# EAGLE schematic EK-TM4C129EXL REV A (EAGLE 6.5.0)

## Sheet 1 of 6: TM4C129ENCPDT GPIO
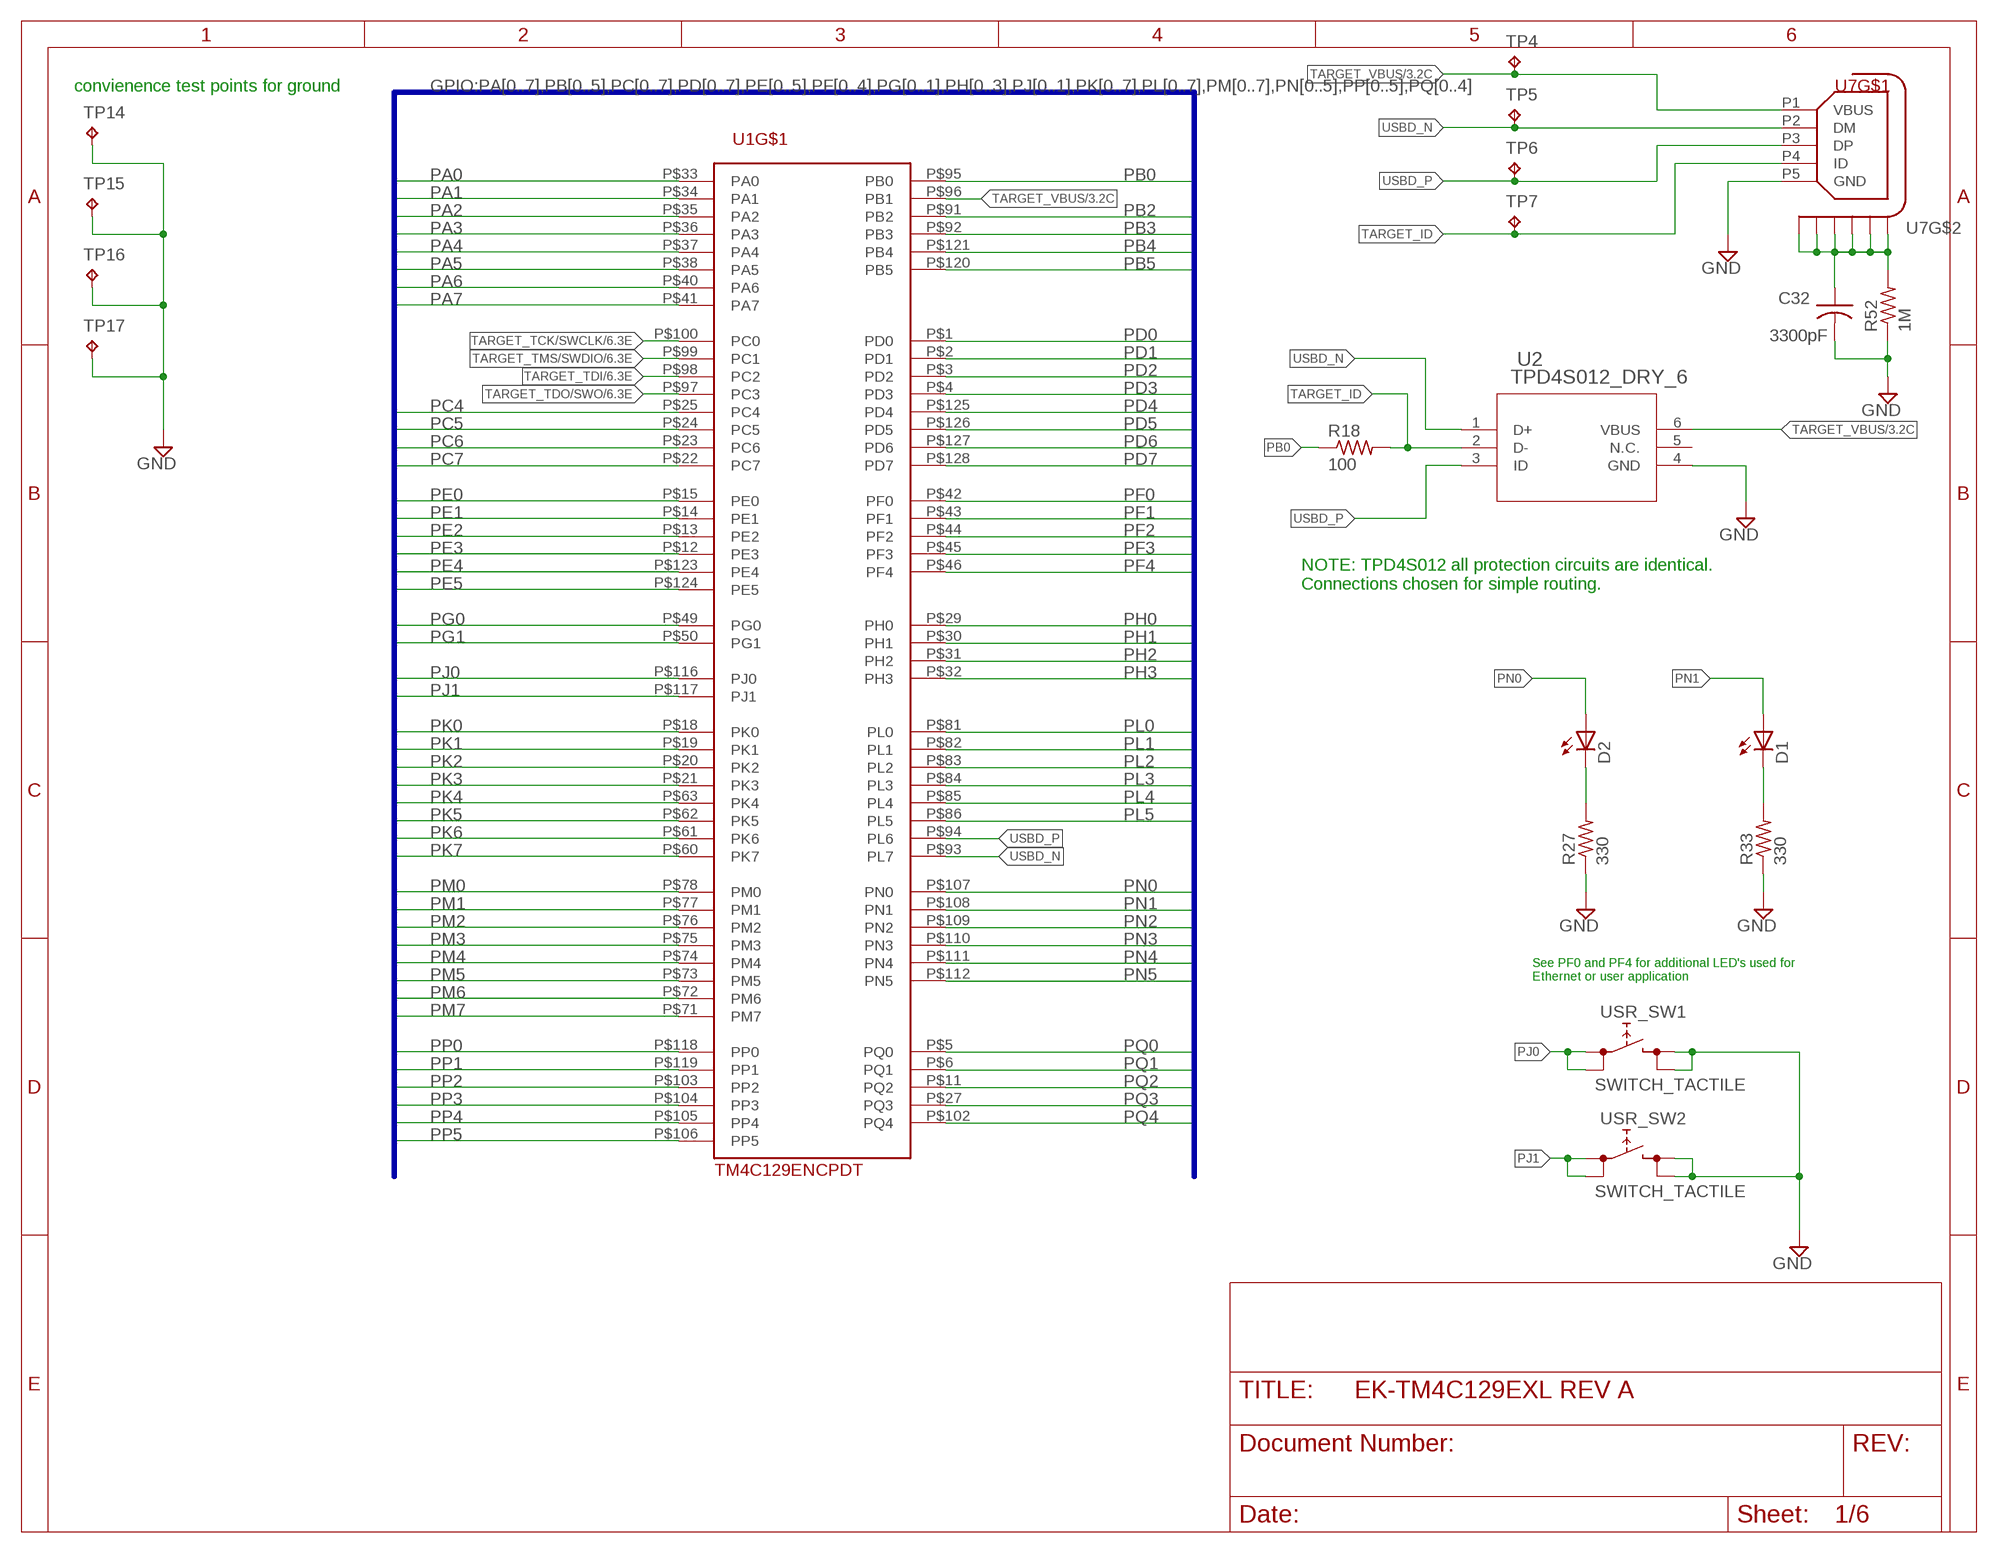
[diagram p0: schematic, sheet 1]

### Parts
C32  3300pF  C-USC0603  [C0603]
D1  LEDCHIPLED_0603  [CHIPLED_0603]
D2  LEDCHIPLED_0603  [CHIPLED_0603]
R18  100  R-US_R0402  [R0402]
R27  330  R-US_R0402  [R0402]
R33  330  R-US_R0402  [R0402]
R52  1M  R-US_R0603  [R0603]
TP4  TPPAD1-13  [P1-13]
TP5  TPPAD1-13  [P1-13]
TP6  TPPAD1-13  [P1-13]
TP7  TPPAD1-13  [P1-13]
TP14  TPPAD1-13  [P1-13]
TP15  TPPAD1-13  [P1-13]
TP16  TPPAD1-13  [P1-13]
TP17  TPPAD1-13  [P1-13]
U1  TM4C129ENCPDT  [TQFP-128]
U2  TPD4S012_DRY_6  [DRY6]
U7  CON_USB_HIROSE_MICRO_AB_ZX62D_AB_5P8  [CON_USB_MICRO_AB_HIROSE_ZX62D-AB-5P8]
USR_SW1  SWITCH_TACTILE  [SWITCH_6MM_6MM_TE_CON_SMD]
USR_SW2  SWITCH_TACTILE  [SWITCH_6MM_6MM_TE_CON_SMD]

### Nets
GND: C32.2 R27.1 R33.1 R52.1 TP14.TP TP15.TP TP16.TP TP17.TP U2.4(GND) U7.P5(GND) USR_SW1.P$3 USR_SW1.P$4 USR_SW2.P$3 USR_SW2.P$4 ; also sheet 2,3,4,5,6
N$6: D1.C R33.2
N$8: C32.1 R52.2 U7.P$1(S1) U7.P$2(S2) U7.P$3(S3) U7.P$4(S4) U7.P$5(S5) U7.P$6(S6)
N$14: D2.C R27.2
PA0: U1.P$33(PA0) ; also sheet 2,3
PA1: U1.P$34(PA1) ; also sheet 2,3
PA2: U1.P$35(PA2) ; also sheet 2,3
PA3: U1.P$36(PA3) ; also sheet 2,3
PA4: U1.P$37(PA4) ; also sheet 2,3
PA5: U1.P$38(PA5) ; also sheet 2,3
PA6: U1.P$40(PA6) ; also sheet 2,3
PA7: U1.P$41(PA7) ; also sheet 2,3
PB0: R18.1 U1.P$95(PB0) ; also sheet 3
PB2: U1.P$91(PB2) ; also sheet 2,3
PB3: U1.P$92(PB3) ; also sheet 2,3
PB4: U1.P$121(PB4) ; also sheet 2,3
PB5: U1.P$120(PB5) ; also sheet 2,3
PC4: U1.P$25(PC4) ; also sheet 2,3
PC5: U1.P$24(PC5) ; also sheet 2,3
PC6: U1.P$23(PC6) ; also sheet 2,3
PC7: U1.P$22(PC7) ; also sheet 2,3
PD0: U1.P$1(PD0) ; also sheet 2,3
PD1: U1.P$2(PD1) ; also sheet 2,3
PD2: U1.P$3(PD2) ; also sheet 2,3
PD3: U1.P$4(PD3) ; also sheet 2,3
PD4: U1.P$125(PD4) ; also sheet 2,3
PD5: U1.P$126(PD5) ; also sheet 2,3
PD6: U1.P$127(PD6) ; also sheet 3,5
PD7: U1.P$128(PD7) ; also sheet 2,3
PE0: U1.P$15(PE0) ; also sheet 2,3
PE1: U1.P$14(PE1) ; also sheet 2,3
PE2: U1.P$13(PE2) ; also sheet 2,3
PE3: U1.P$12(PE3) ; also sheet 2,3
PE4: U1.P$123(PE4) ; also sheet 2,3
PE5: U1.P$124(PE5) ; also sheet 2,3
PF0: U1.P$42(PF0) ; also sheet 3,4
PF1: U1.P$43(PF1) ; also sheet 2,3
PF2: U1.P$44(PF2) ; also sheet 2,3
PF3: U1.P$45(PF3) ; also sheet 2,3
PF4: U1.P$46(PF4) ; also sheet 3,4
PG0: U1.P$49(PG0) ; also sheet 2,3
PG1: U1.P$50(PG1) ; also sheet 2,3
PH0: U1.P$29(PH0) ; also sheet 2,3
PH1: U1.P$30(PH1) ; also sheet 2,3
PH2: U1.P$31(PH2) ; also sheet 2,3
PH3: U1.P$32(PH3) ; also sheet 2,3
PJ0: U1.P$116(PJ0) USR_SW1.P$1 USR_SW1.P$2 ; also sheet 3
PJ1: U1.P$117(PJ1) USR_SW2.P$1 USR_SW2.P$2 ; also sheet 3
PK0: U1.P$18(PK0) ; also sheet 2,3
PK1: U1.P$19(PK1) ; also sheet 2,3
PK2: U1.P$20(PK2) ; also sheet 2,3
PK3: U1.P$21(PK3) ; also sheet 2,3
PK4: U1.P$63(PK4) ; also sheet 2,3
PK5: U1.P$62(PK5) ; also sheet 2,3
PK6: U1.P$61(PK6) ; also sheet 2,3
PK7: U1.P$60(PK7) ; also sheet 2,3
PL0: U1.P$81(PL0) ; also sheet 2,3
PL1: U1.P$82(PL1) ; also sheet 2,3
PL2: U1.P$83(PL2) ; also sheet 2,3
PL3: U1.P$84(PL3) ; also sheet 2,3
PL4: U1.P$85(PL4) ; also sheet 2,3
PL5: U1.P$86(PL5) ; also sheet 2,3
PM0: U1.P$78(PM0) ; also sheet 2,3
PM1: U1.P$77(PM1) ; also sheet 2,3
PM2: U1.P$76(PM2) ; also sheet 2,3
PM3: U1.P$75(PM3) ; also sheet 2,3
PM4: U1.P$74(PM4) ; also sheet 2,3
PM5: U1.P$73(PM5) ; also sheet 2,3
PM6: U1.P$72(PM6) ; also sheet 2,3
PM7: U1.P$71(PM7) ; also sheet 2,3
PN0: D2.A U1.P$107(PN0) ; also sheet 3
PN1: D1.A U1.P$108(PN1) ; also sheet 3
PN2: U1.P$109(PN2) ; also sheet 2,3
PN3: U1.P$110(PN3) ; also sheet 2,3
PN4: U1.P$111(PN4) ; also sheet 2,3
PN5: U1.P$112(PN5) ; also sheet 2,3
PP0: U1.P$118(PP0) ; also sheet 2,3
PP1: U1.P$119(PP1) ; also sheet 2,3
PP2: U1.P$103(PP2) ; also sheet 2,3
PP3: U1.P$104(PP3) ; also sheet 2,3
PP4: U1.P$105(PP4) ; also sheet 2,3
PP5: U1.P$106(PP5) ; also sheet 2,3
PQ0: U1.P$5(PQ0) ; also sheet 2,3
PQ1: U1.P$6(PQ1) ; also sheet 2,3
PQ2: U1.P$11(PQ2) ; also sheet 2,3
PQ3: U1.P$27(PQ3) ; also sheet 2,3
PQ4: U1.P$102(PQ4) ; also sheet 3,5
TARGET_ID: R18.2 TP7.TP U2.2(D-) U7.P4(ID)
TARGET_TCK/SWCLK: U1.P$100(PC0) ; also sheet 6
TARGET_TDI: U1.P$98(PC2) ; also sheet 6
TARGET_TDO/SWO: U1.P$97(PC3) ; also sheet 6
TARGET_TMS/SWDIO: U1.P$99(PC1) ; also sheet 6
TARGET_VBUS: TP4.TP U1.P$96(PB1) U2.6(VBUS) U7.P1(VBUS) ; also sheet 3,5
USBD_N [USB]: TP5.TP U1.P$93(PL7) U2.1(D+) U7.P2(DM)
USBD_P [USB]: TP6.TP U1.P$94(PL6) U2.3(ID) U7.P3(DP)
Unconnected: U2.5(N.C.)

### Buses
GPIO:PA[0..7],PB[0..5],PC[0..7],PD[0..7],PE[0..5],PF[0..4],PG[0..1],PH[0..3],PJ[0..1],PK[0..7],PL[0..7],PM[0..7],PN[0..5],PP[0..5],PQ[0..4]

### Notes on the sheet
- convienence test points for ground
- NOTE: TPD4S012 all protection circuits are identical.  
  Connections chosen for simple routing.
- See PF0 and PF4 for additional LED's used for
  Ethernet or user application

## Sheet 2 of 6: BoosterPack Interface
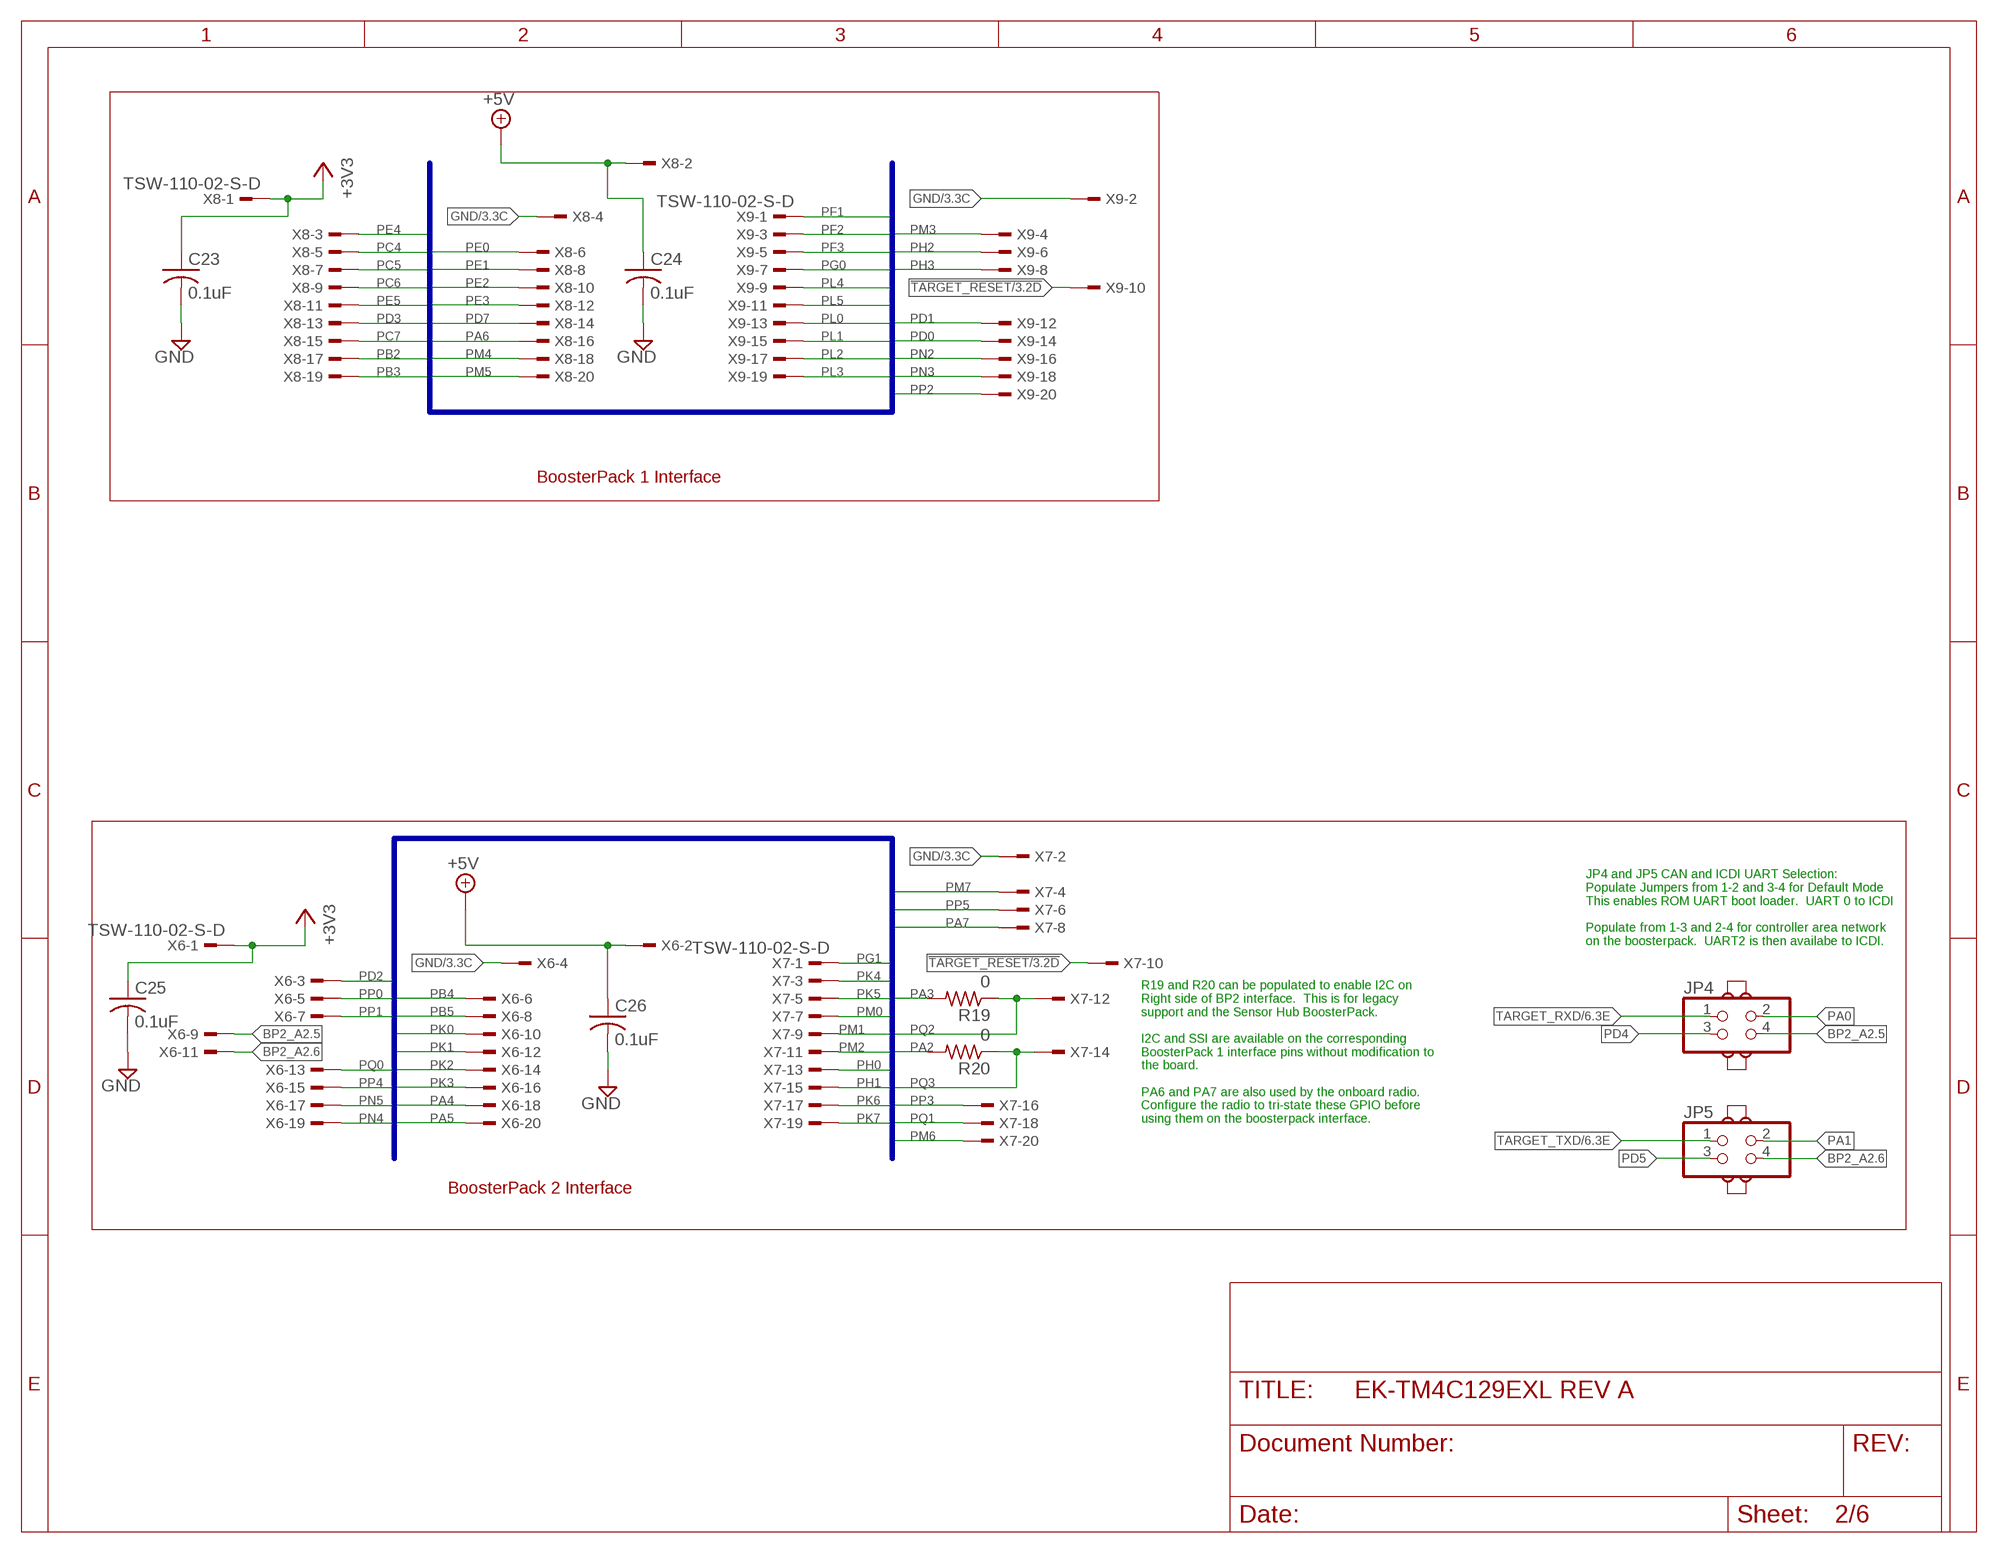
[diagram p1: schematic, sheet 2]

### Parts
C23  0.1uF  C-USC0402  [C0402]
C24  0.1uF  C-USC0402  [C0402]
C25  0.1uF  C-USC0402  [C0402]
C26  0.1uF  C-USC0402  [C0402]
J4  JUMPER  [JUMP]
J5  JUMPER  [JUMP]
J6  JUMPER  [JUMP]
J7  JUMPER  [JUMP]
JP4  PINHD-2X2  [2X02]
JP5  PINHD-2X2  [2X02]
R19  0  R-US_R0402  [R0402]
R20  0  R-US_R0402  [R0402]
X6  TSW-110-02-S-D  [TSW-110-02-S-D]
X7  TSW-110-02-S-D  [TSW-110-02-S-D]
X8  TSW-110-02-S-D  [TSW-110-02-S-D]
X9  TSW-110-02-S-D  [TSW-110-02-S-D]

### Nets
!TARGET_RESET: X7.10 X9.10 ; also sheet 3,5,6
+3V3: C23.1 C25.1 X6.1 X8.1 ; also sheet 3,5,6
+5V: C24.1 C26.1 X6.2 X8.2 ; also sheet 3,5
BP2_A2.5: JP4.4 X6.9
BP2_A2.6: JP5.4 X6.11
GND: C23.2 C24.2 C25.2 C26.2 X6.4 X7.2 X8.4 X9.2 ; also sheet 1,3,4,5,6
PA0: JP4.2 ; also sheet 1,3
PA1: JP5.2 ; also sheet 1,3
PA2: R20.2 ; also sheet 1,3
PA3: R19.2 ; also sheet 1,3
PA4: X6.18 ; also sheet 1,3
PA5: X6.20 ; also sheet 1,3
PA6: X8.16 ; also sheet 1,3
PA7: X7.8 ; also sheet 1,3
PB2: X8.17 ; also sheet 1,3
PB3: X8.19 ; also sheet 1,3
PB4: X6.6 ; also sheet 1,3
PB5: X6.8 ; also sheet 1,3
PC4: X8.5 ; also sheet 1,3
PC5: X8.7 ; also sheet 1,3
PC6: X8.9 ; also sheet 1,3
PC7: X8.15 ; also sheet 1,3
PD0: X9.14 ; also sheet 1,3
PD1: X9.12 ; also sheet 1,3
PD2: X6.3 ; also sheet 1,3
PD3: X8.13 ; also sheet 1,3
PD4: JP4.3 ; also sheet 1,3
PD5: JP5.3 ; also sheet 1,3
PD7: X8.14 ; also sheet 1,3
PE0: X8.6 ; also sheet 1,3
PE1: X8.8 ; also sheet 1,3
PE2: X8.10 ; also sheet 1,3
PE3: X8.12 ; also sheet 1,3
PE4: X8.3 ; also sheet 1,3
PE5: X8.11 ; also sheet 1,3
PF1: X9.1 ; also sheet 1,3
PF2: X9.3 ; also sheet 1,3
PF3: X9.5 ; also sheet 1,3
PG0: X9.7 ; also sheet 1,3
PG1: X7.1 ; also sheet 1,3
PH0: X7.13 ; also sheet 1,3
PH1: X7.15 ; also sheet 1,3
PH2: X9.6 ; also sheet 1,3
PH3: X9.8 ; also sheet 1,3
PK0: X6.10 ; also sheet 1,3
PK1: X6.12 ; also sheet 1,3
PK2: X6.14 ; also sheet 1,3
PK3: X6.16 ; also sheet 1,3
PK4: X7.3 ; also sheet 1,3
PK5: X7.5 ; also sheet 1,3
PK6: X7.17 ; also sheet 1,3
PK7: X7.19 ; also sheet 1,3
PL0: X9.13 ; also sheet 1,3
PL1: X9.15 ; also sheet 1,3
PL2: X9.17 ; also sheet 1,3
PL3: X9.19 ; also sheet 1,3
PL4: X9.9 ; also sheet 1,3
PL5: X9.11 ; also sheet 1,3
PM0: X7.7 ; also sheet 1,3
PM1: X7.9 ; also sheet 1,3
PM2: X7.11 ; also sheet 1,3
PM3: X9.4 ; also sheet 1,3
PM4: X8.18 ; also sheet 1,3
PM5: X8.20 ; also sheet 1,3
PM6: X7.20 ; also sheet 1,3
PM7: X7.4 ; also sheet 1,3
PN2: X9.16 ; also sheet 1,3
PN3: X9.18 ; also sheet 1,3
PN4: X6.19 ; also sheet 1,3
PN5: X6.17 ; also sheet 1,3
PP0: X6.5 ; also sheet 1,3
PP1: X6.7 ; also sheet 1,3
PP2: X9.20 ; also sheet 1,3
PP3: X7.16 ; also sheet 1,3
PP4: X6.15 ; also sheet 1,3
PP5: X7.6 ; also sheet 1,3
PQ0: X6.13 ; also sheet 1,3
PQ1: X7.18 ; also sheet 1,3
PQ2: R19.1 X7.12 ; also sheet 1,3
PQ3: R20.1 X7.14 ; also sheet 1,3
TARGET_RXD: JP4.1 ; also sheet 6
TARGET_TXD: JP5.1 ; also sheet 6

### Buses
GPIO:PA[0..7],PB[0..5],PC[0..7],PD[0..7],PE[0..5],PF[0..4],PG[0..1],PH[0..3],PJ[0..1],PK[0..7],PL[0..7],PM[0..7],PN[0..5],PP[0..5],PQ[0..4]

### Notes on the sheet
- BoosterPack 1 Interface
- JP4 and JP5 CAN and ICDI UART Selection:
  Populate Jumpers from 1-2 and 3-4 for Default Mode
  This enables ROM UART boot loader.  UART 0 to ICDI
  
  Populate from 1-3 and 2-4 for controller area network
  on the boosterpack.  UART2 is then availabe to ICDI.
- R19 and R20 can be populated to enable I2C on 
  Right side of BP2 interface.  This is for legacy 
  support and the Sensor Hub BoosterPack.
  
  I2C and SSI are available on the corresponding
  BoosterPack 1 interface pins without modification to
  the board.
  
  PA6 and PA7 are also used by the onboard radio. 
  Configure the radio to tri-state these GPIO before 
  using them on the boosterpack interface.
- BoosterPack 2 Interface

## Sheet 3 of 6: GPIO Breakout
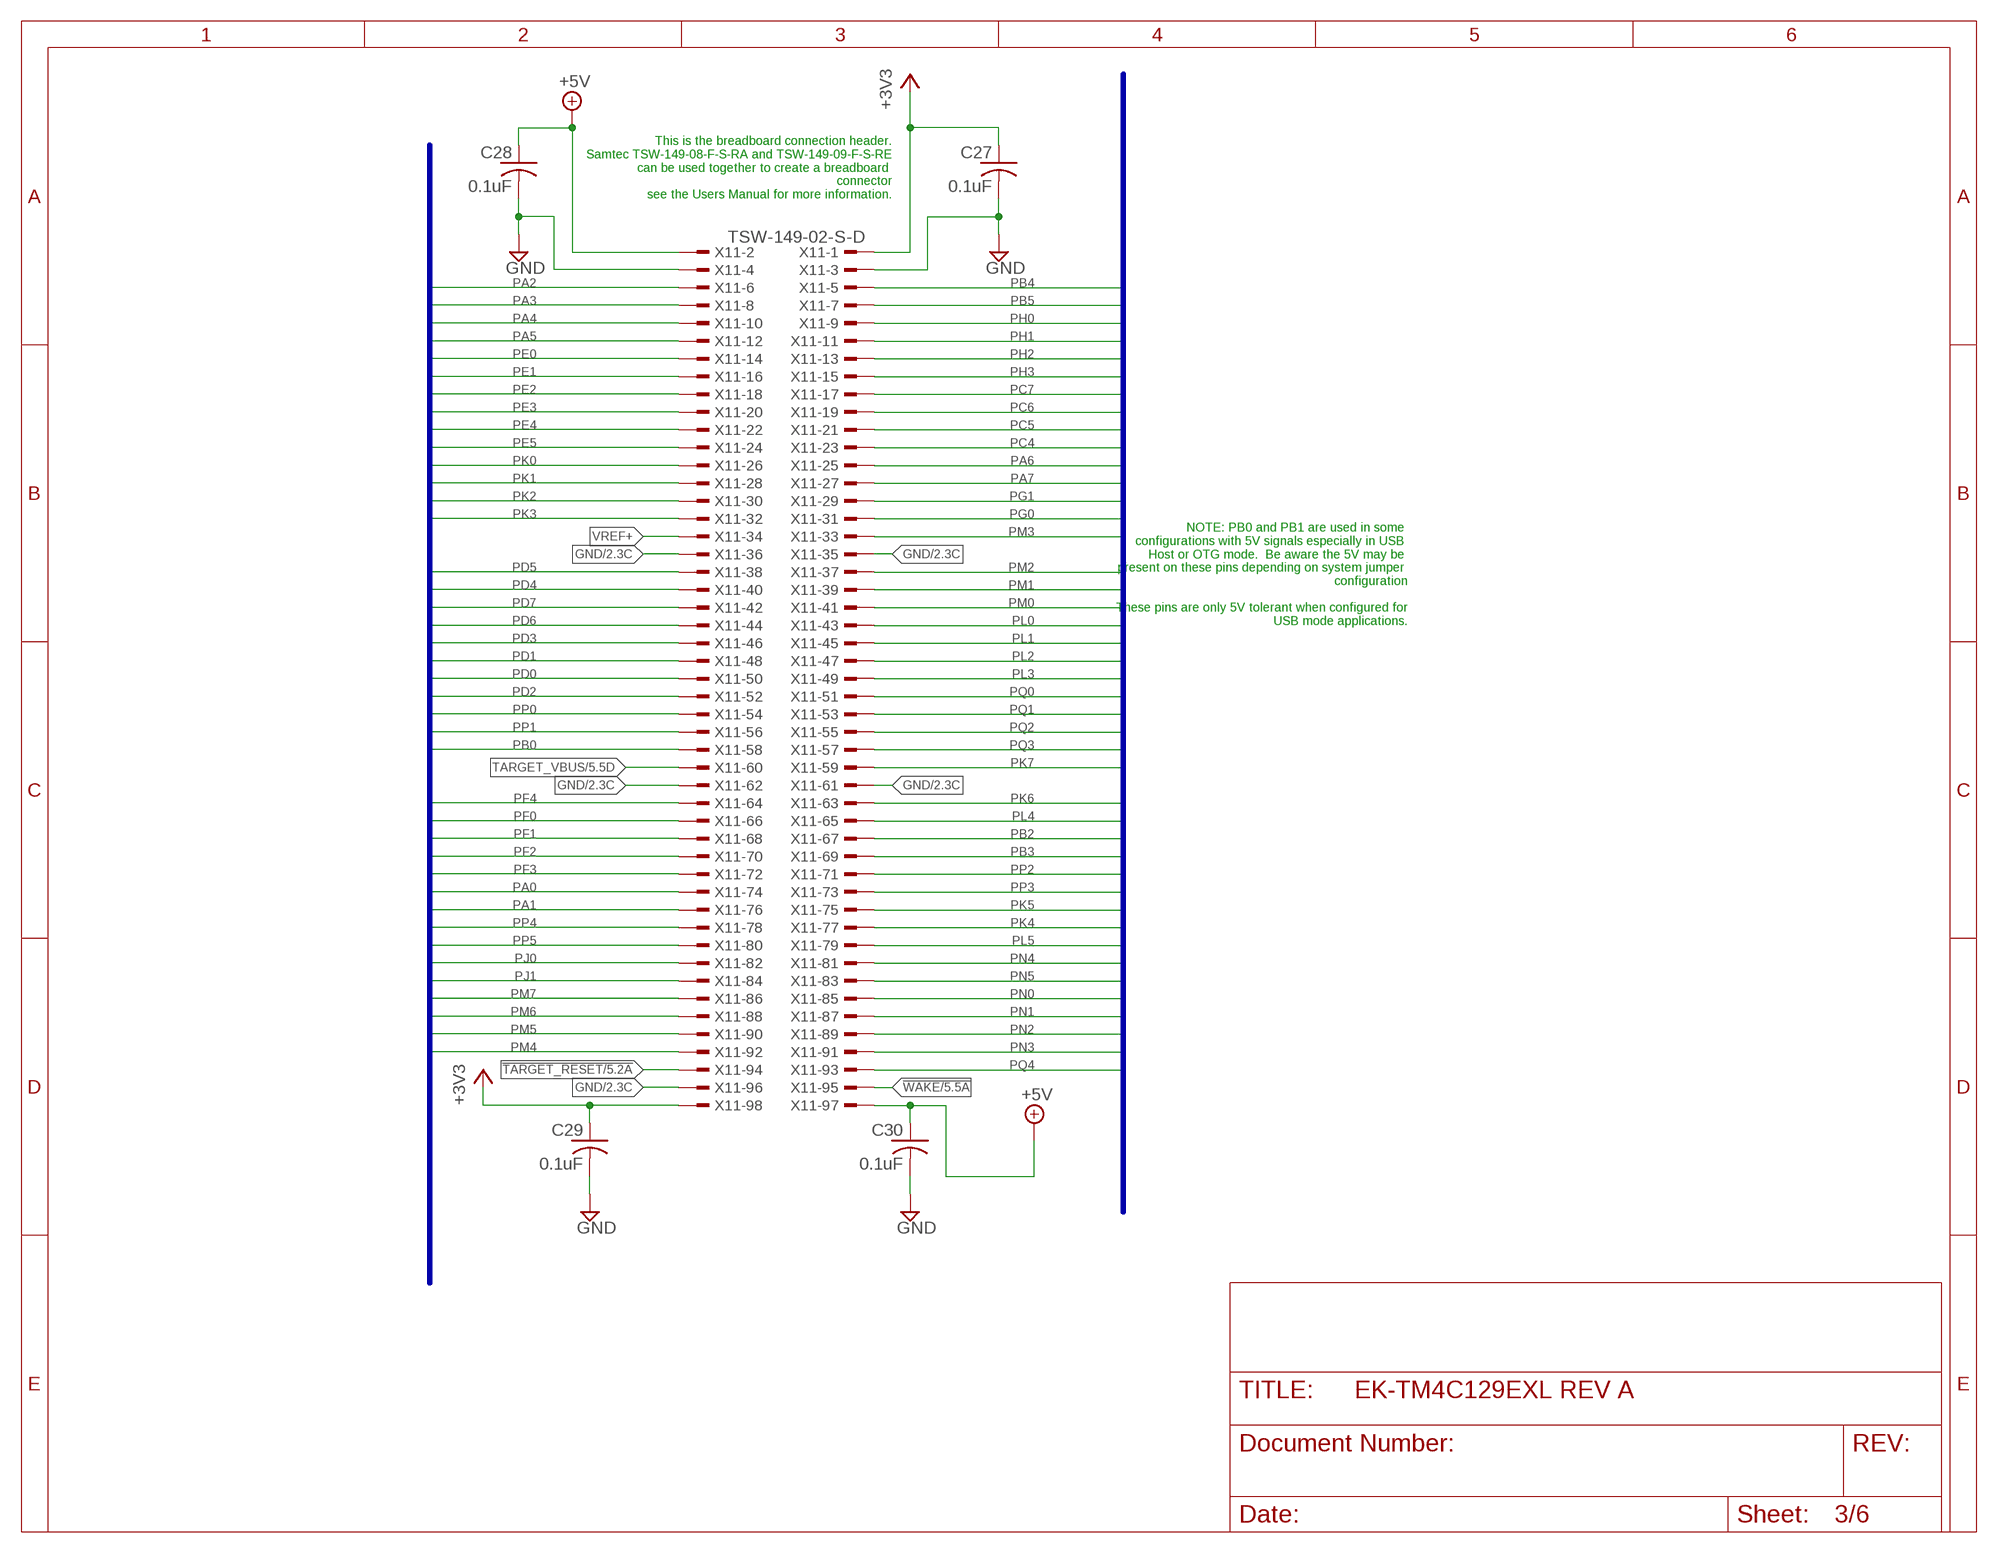
[diagram p2: schematic, sheet 3]

### Parts
C27  0.1uF  C-USC0402  [C0402]
C28  0.1uF  C-USC0402  [C0402]
C29  0.1uF  C-USC0402  [C0402]
C30  0.1uF  C-USC0402  [C0402]
X11  TSW-149-02-S-D  [TSW-149-02-S-D]

### Nets
!TARGET_RESET: X11.94 ; also sheet 2,5,6
!WAKE: X11.95 ; also sheet 5
+3V3: C27.1 C29.1 X11.1 X11.98 ; also sheet 2,5,6
+5V: C28.1 C30.1 X11.2 X11.97 ; also sheet 2,5
GND: C27.2 C28.2 C29.2 C30.2 X11.3 X11.4 X11.35 X11.36 X11.61 X11.62 X11.96 ; also sheet 1,2,4,5,6
PA0: X11.74 ; also sheet 1,2
PA1: X11.76 ; also sheet 1,2
PA2: X11.6 ; also sheet 1,2
PA3: X11.8 ; also sheet 1,2
PA4: X11.10 ; also sheet 1,2
PA5: X11.12 ; also sheet 1,2
PA6: X11.25 ; also sheet 1,2
PA7: X11.27 ; also sheet 1,2
PB0: X11.58 ; also sheet 1
PB2: X11.67 ; also sheet 1,2
PB3: X11.69 ; also sheet 1,2
PB4: X11.5 ; also sheet 1,2
PB5: X11.7 ; also sheet 1,2
PC4: X11.23 ; also sheet 1,2
PC5: X11.21 ; also sheet 1,2
PC6: X11.19 ; also sheet 1,2
PC7: X11.17 ; also sheet 1,2
PD0: X11.50 ; also sheet 1,2
PD1: X11.48 ; also sheet 1,2
PD2: X11.52 ; also sheet 1,2
PD3: X11.46 ; also sheet 1,2
PD4: X11.40 ; also sheet 1,2
PD5: X11.38 ; also sheet 1,2
PD6: X11.44 ; also sheet 1,5
PD7: X11.42 ; also sheet 1,2
PE0: X11.14 ; also sheet 1,2
PE1: X11.16 ; also sheet 1,2
PE2: X11.18 ; also sheet 1,2
PE3: X11.20 ; also sheet 1,2
PE4: X11.22 ; also sheet 1,2
PE5: X11.24 ; also sheet 1,2
PF0: X11.66 ; also sheet 1,4
PF1: X11.68 ; also sheet 1,2
PF2: X11.70 ; also sheet 1,2
PF3: X11.72 ; also sheet 1,2
PF4: X11.64 ; also sheet 1,4
PG0: X11.31 ; also sheet 1,2
PG1: X11.29 ; also sheet 1,2
PH0: X11.9 ; also sheet 1,2
PH1: X11.11 ; also sheet 1,2
PH2: X11.13 ; also sheet 1,2
PH3: X11.15 ; also sheet 1,2
PJ0: X11.82 ; also sheet 1
PJ1: X11.84 ; also sheet 1
PK0: X11.26 ; also sheet 1,2
PK1: X11.28 ; also sheet 1,2
PK2: X11.30 ; also sheet 1,2
PK3: X11.32 ; also sheet 1,2
PK4: X11.77 ; also sheet 1,2
PK5: X11.75 ; also sheet 1,2
PK6: X11.63 ; also sheet 1,2
PK7: X11.59 ; also sheet 1,2
PL0: X11.43 ; also sheet 1,2
PL1: X11.45 ; also sheet 1,2
PL2: X11.47 ; also sheet 1,2
PL3: X11.49 ; also sheet 1,2
PL4: X11.65 ; also sheet 1,2
PL5: X11.79 ; also sheet 1,2
PM0: X11.41 ; also sheet 1,2
PM1: X11.39 ; also sheet 1,2
PM2: X11.37 ; also sheet 1,2
PM3: X11.33 ; also sheet 1,2
PM4: X11.92 ; also sheet 1,2
PM5: X11.90 ; also sheet 1,2
PM6: X11.88 ; also sheet 1,2
PM7: X11.86 ; also sheet 1,2
PN0: X11.85 ; also sheet 1
PN1: X11.87 ; also sheet 1
PN2: X11.89 ; also sheet 1,2
PN3: X11.91 ; also sheet 1,2
PN4: X11.81 ; also sheet 1,2
PN5: X11.83 ; also sheet 1,2
PP0: X11.54 ; also sheet 1,2
PP1: X11.56 ; also sheet 1,2
PP2: X11.71 ; also sheet 1,2
PP3: X11.73 ; also sheet 1,2
PP4: X11.78 ; also sheet 1,2
PP5: X11.80 ; also sheet 1,2
PQ0: X11.51 ; also sheet 1,2
PQ1: X11.53 ; also sheet 1,2
PQ2: X11.55 ; also sheet 1,2
PQ3: X11.57 ; also sheet 1,2
PQ4: X11.93 ; also sheet 1,5
TARGET_VBUS: X11.60 ; also sheet 1,5
VREF+: X11.34 ; also sheet 5

### Buses
GPIO:PA[0..7],PB[0..5],PC[0..7],PD[0..7],PE[0..5],PF[0..4],PG[0..1],PH[0..3],PJ[0..1],PK[0..7],PL[0..7],PM[0..7],PN[0..5],PP[0..5],PQ[0..4]

### Notes on the sheet
- This is the breadboard connection header.
  Samtec TSW-149-08-F-S-RA and TSW-149-09-F-S-RE
  can be used together to create a breadboard 
  connector
  see the Users Manual for more information.
- NOTE: PB0 and PB1 are used in some 
  configurations with 5V signals especially in USB 
  Host or OTG mode.  Be aware the 5V may be 
  present on these pins depending on system jumper 
  configuration
  
  These pins are only 5V tolerant when configured for
  USB mode applications.

## Sheet 4 of 6: Ethernet
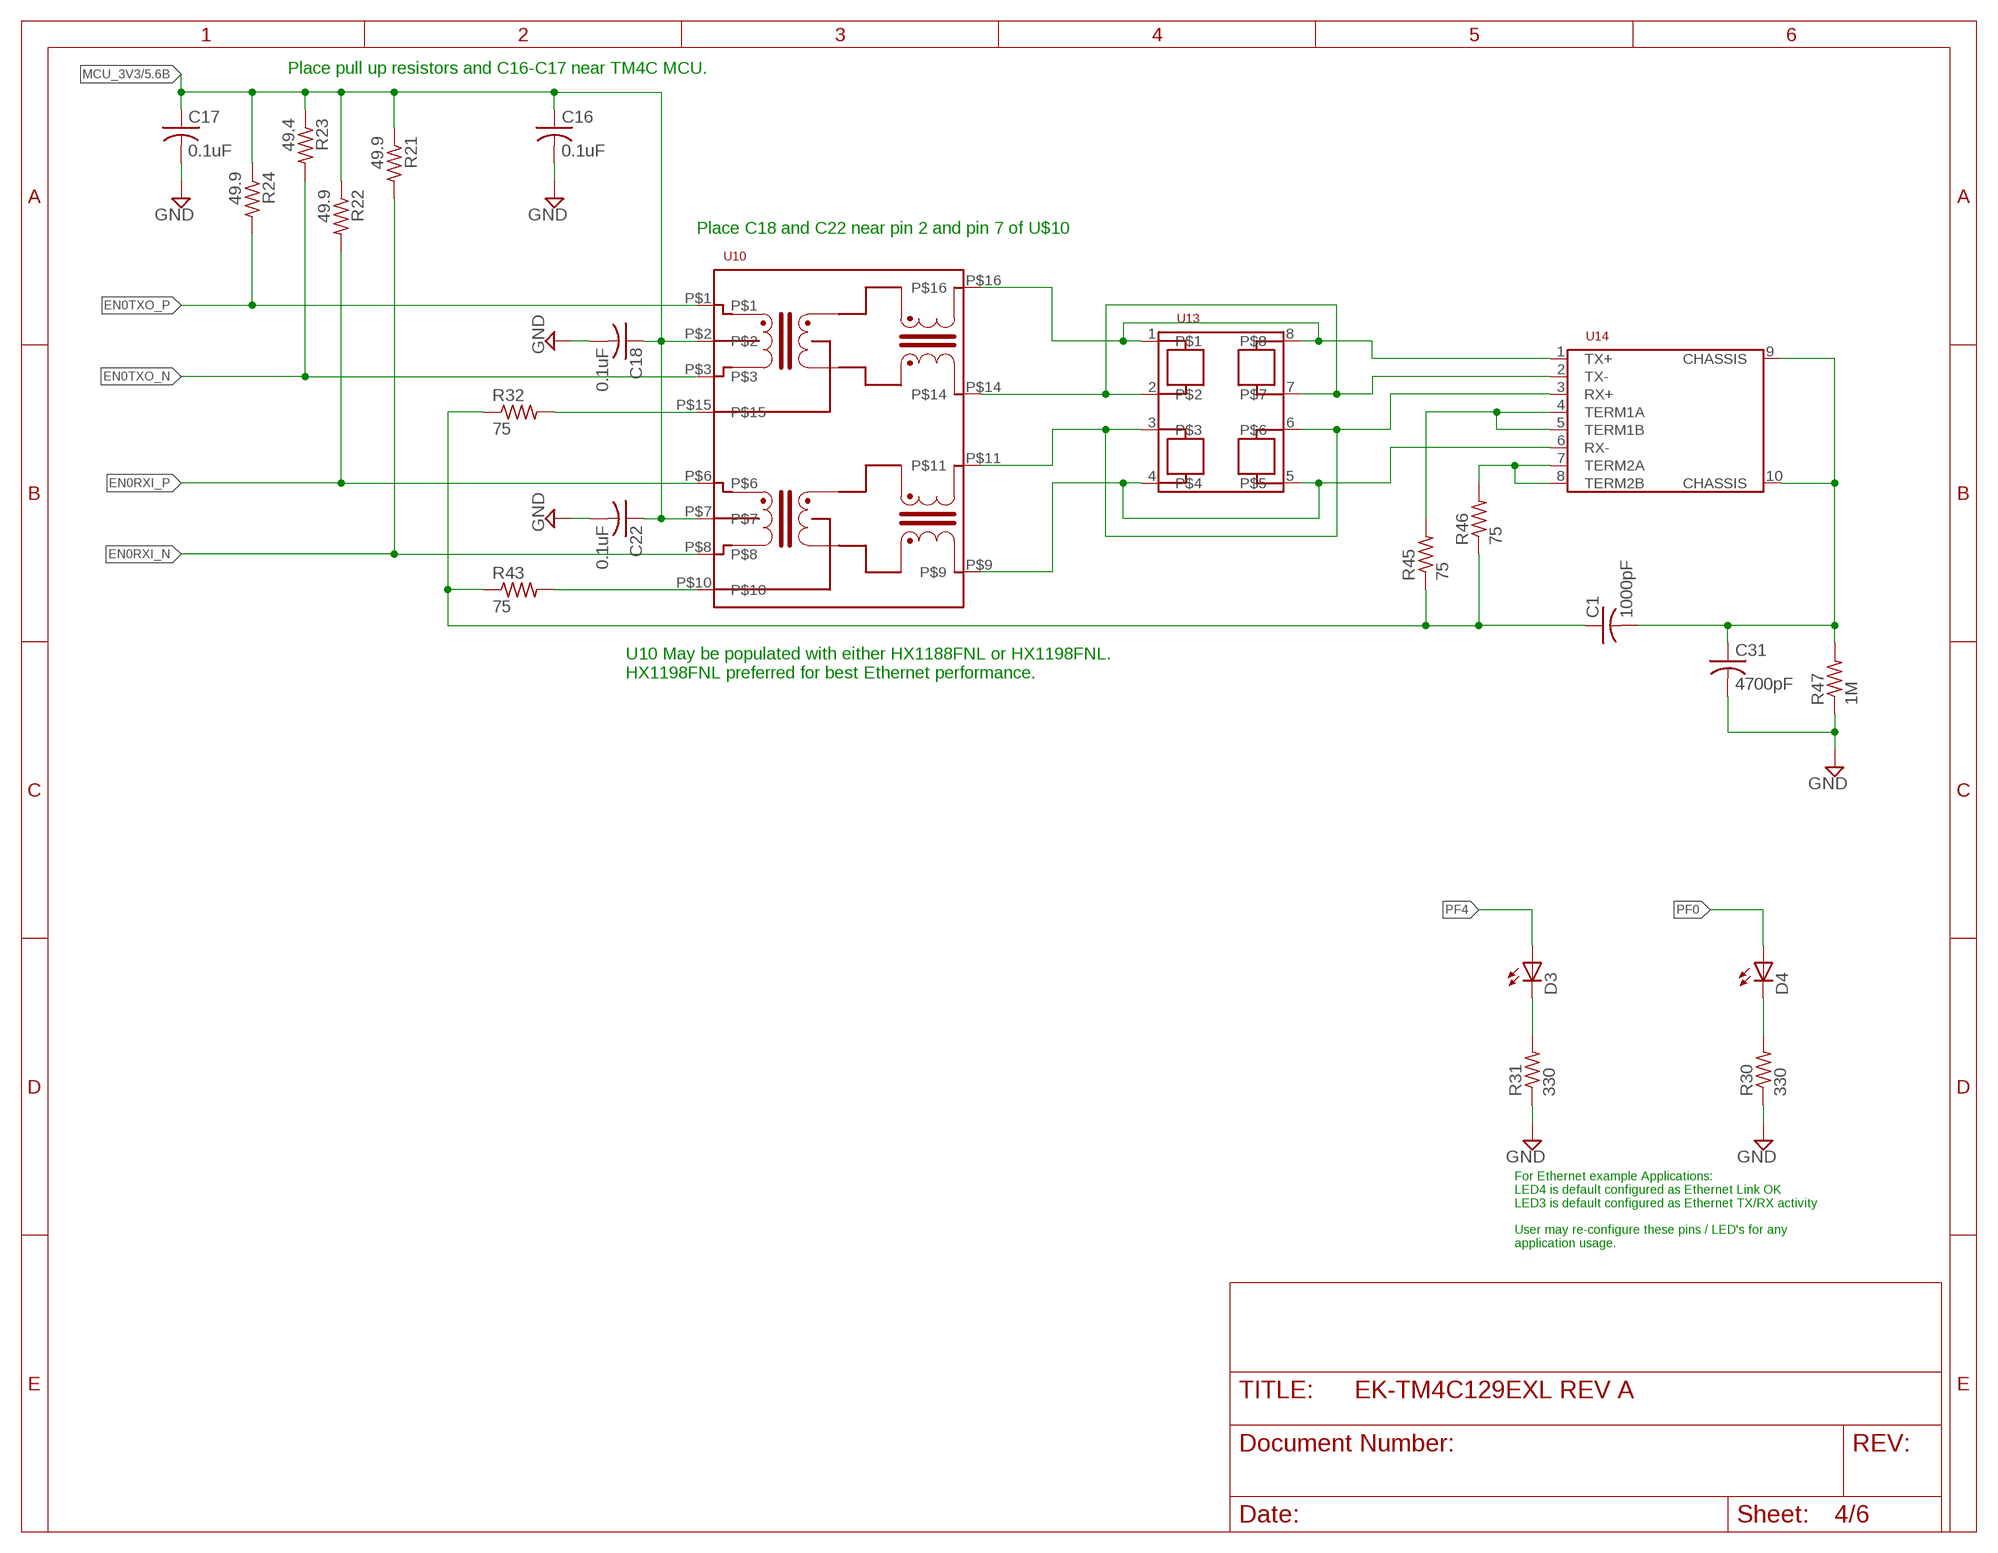
[diagram p3: schematic, sheet 4]

### Parts
C1  1000pF  C-USC1210  [C1210]
C16  0.1uF  C-USC0402  [C0402]
C17  0.1uF  C-USC0402  [C0402]
C18  0.1uF  C-USC0402  [C0402]
C22  0.1uF  C-USC0402  [C0402]
C31  4700pF  C-USC1812  [C1812]
D3  LEDCHIPLED_0603  [CHIPLED_0603]
D4  LEDCHIPLED_0603  [CHIPLED_0603]
R21  49.9  R-US_R0402  [R0402]
R22  49.9  R-US_R0402  [R0402]
R23  49.4  R-US_R0402  [R0402]
R24  49.9  R-US_R0402  [R0402]
R30  330  R-US_R0402  [R0402]
R31  330  R-US_R0402  [R0402]
R32  75  R-US_R0402  [R0402]
R43  75  R-US_R0402  [R0402]
R45  75  R-US_R0402  [R0402]
R46  75  R-US_R0402  [R0402]
R47  1M  R-US_R1206  [R1206]
U10  MAG_PULSE_HX1188FNL  [MAG_PULSE_HX1188FNL]
U13  SLVU2.8-4  [D8]
U14  JACK_RJ45_NOMAG_NOLED_TECON  [RJ45_TE_CON_NOMAG_NOLED]

### Nets
CHASSIS: C1.2 C31.1 R47.2 U14.9(CHASSIS) U14.10(CHASSIS)
EN0RXI_N [Ethernet]: R21.2 U10.P$8 ; also sheet 5
EN0RXI_P [Ethernet]: R22.2 U10.P$6 ; also sheet 5
EN0TXO_N [Ethernet]: R23.2 U10.P$3 ; also sheet 5
EN0TXO_P [Ethernet]: R24.2 U10.P$1 ; also sheet 5
GND: C16.2 C17.2 C18.2 C22.2 C31.2 R30.1 R31.1 R47.1 ; also sheet 1,2,3,5,6
JACK_RX_N [Ethernet]: U10.P$9 U13.4 U13.5 U14.6(RX-)
JACK_RX_P [Ethernet]: U10.P$11 U13.3 U13.6 U14.3(RX+)
JACK_TX_N [Ethernet]: U10.P$14 U13.2 U13.7 U14.2(TX-)
JACK_TX_P [Ethernet]: U10.P$16 U13.1 U13.8 U14.1(TX+)
MCU_3V3: C16.1 C17.1 C18.1 C22.1 R21.1 R22.1 R23.1 R24.1 U10.P$2 U10.P$7 ; also sheet 5,6
N$4: D4.C R30.2
N$5: D3.C R31.2
N$32: R32.2 U10.P$15
N$34: R43.2 U10.P$10
N$36: C1.1 R32.1 R43.1 R45.1 R46.1
N$44: R45.2 U14.4(TERM1A) U14.5(TERM1B)
N$45: R46.2 U14.7(TERM2A) U14.8(TERM2B)
PF0: D4.A ; also sheet 1,3
PF4: D3.A ; also sheet 1,3

### Notes on the sheet
- Place pull up resistors and C16-C17 near TM4C MCU.
- Place C18 and C22 near pin 2 and pin 7 of U$10
- U10 May be populated with either HX1188FNL or HX1198FNL. 
  HX1198FNL preferred for best Ethernet performance.
- For Ethernet example Applications: 
  LED4 is default configured as Ethernet Link OK
  LED3 is default configured as Ethernet TX/RX activity
  
  User may re-configure these pins / LED's for any
  application usage.

## Sheet 5 of 6: Power
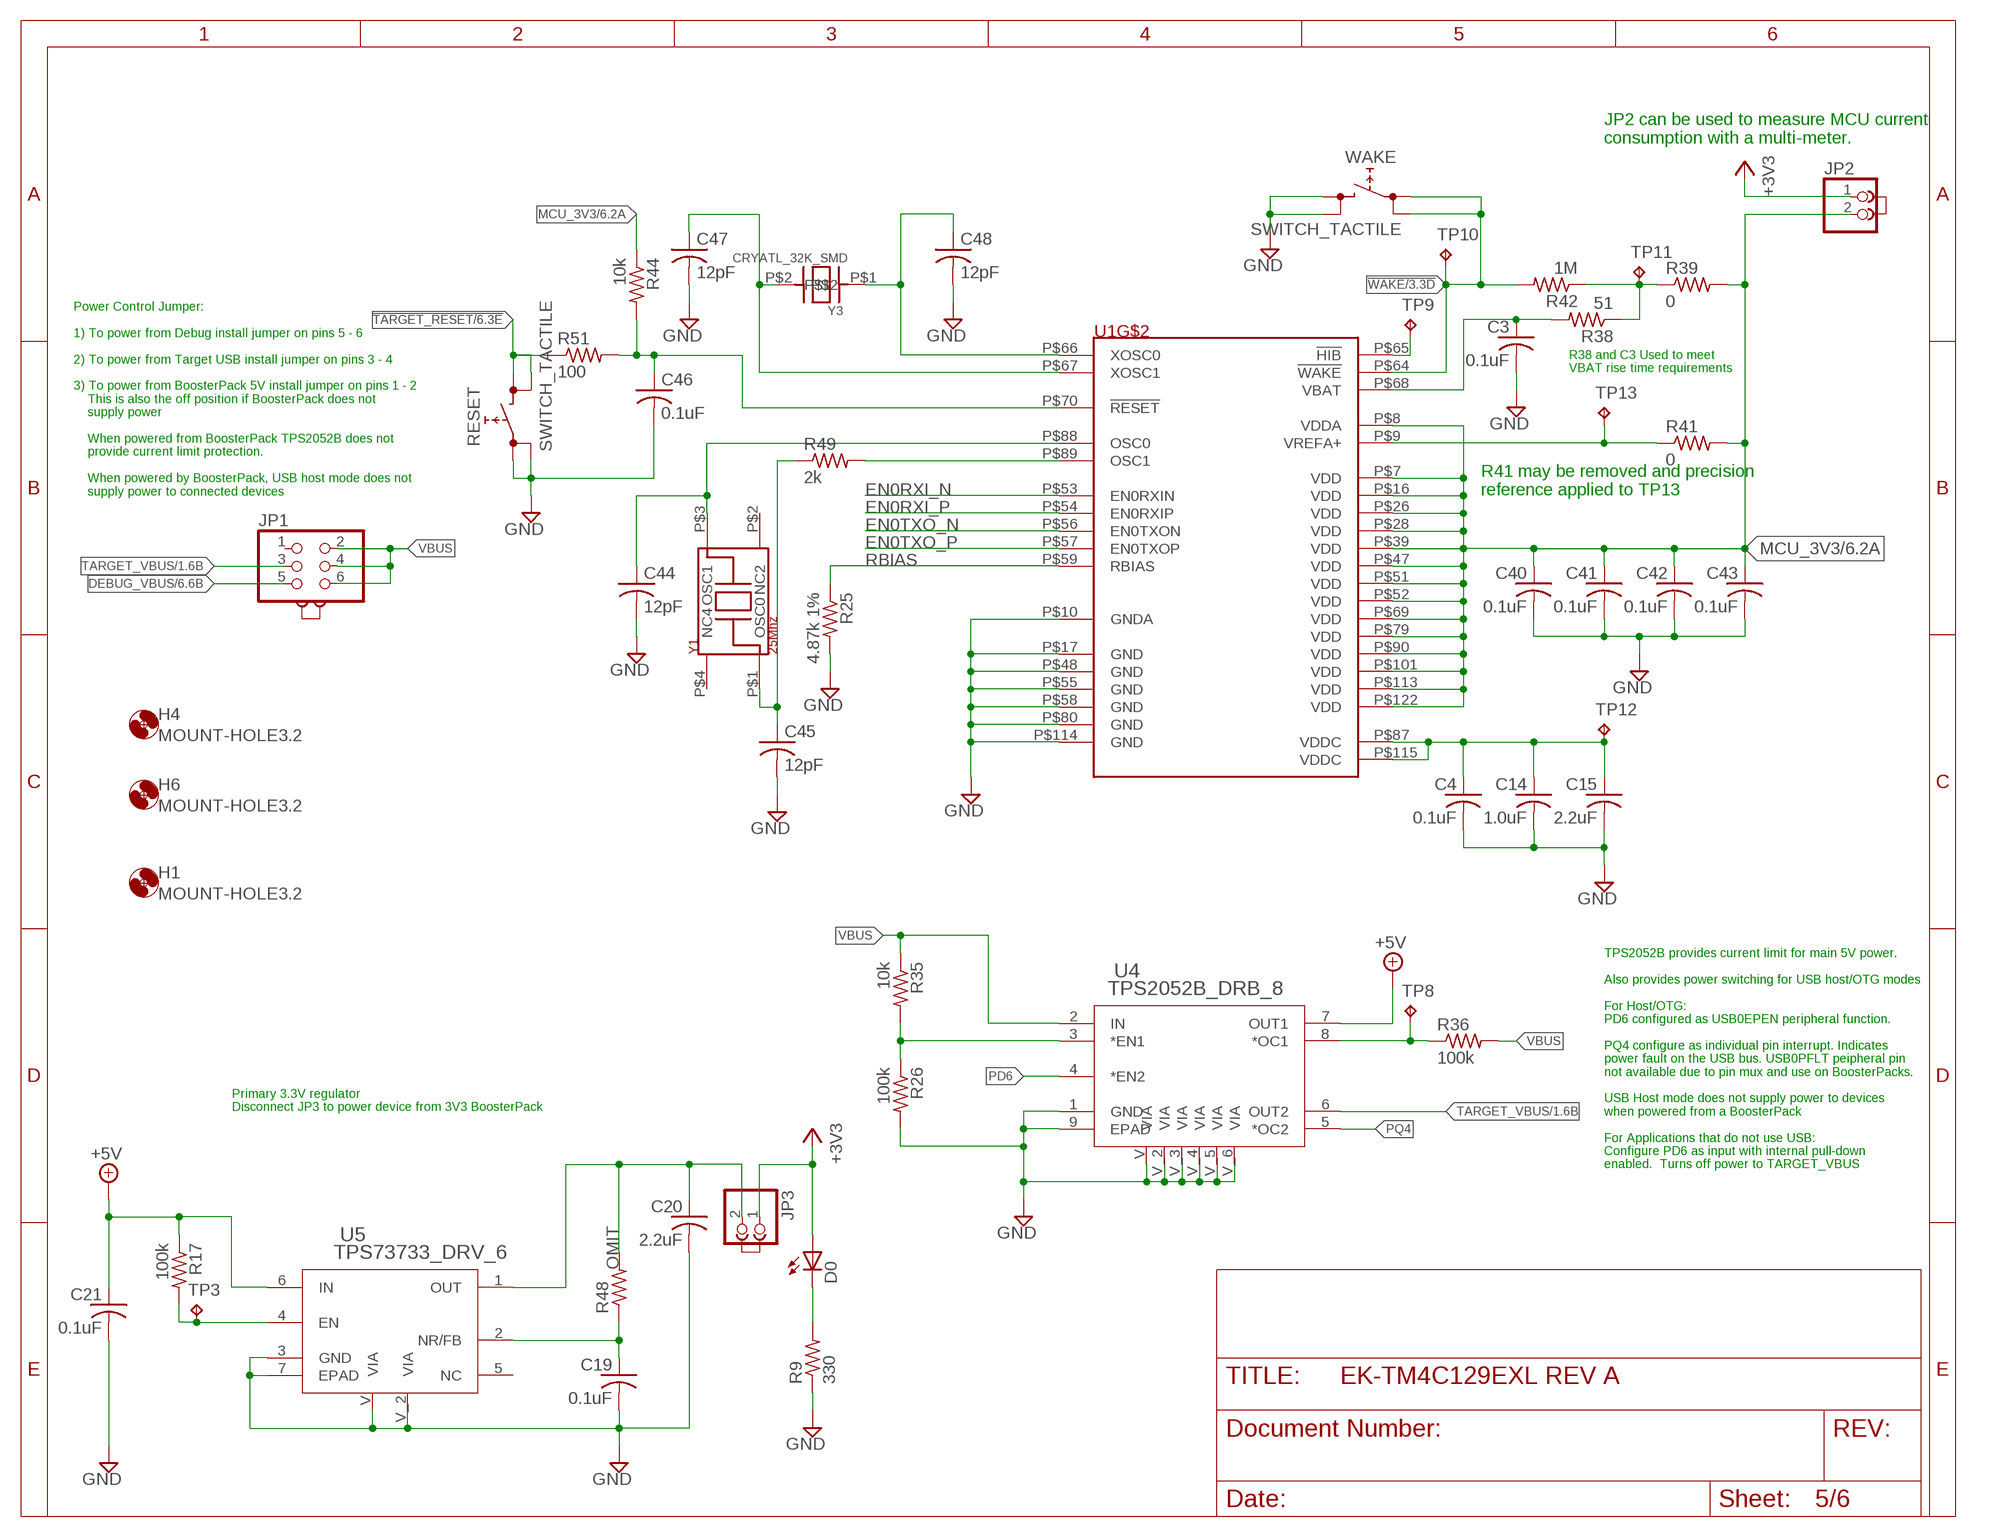
[diagram p4: schematic, sheet 5]

### Parts
C3  0.1uF  C-USC0402  [C0402]
C4  0.1uF  C-USC0402  [C0402]
C14  1.0uF  C-USC0402  [C0402]
C15  2.2uF  C-USC0603K  [C0603K]
C19  0.1uF  C-USC0402  [C0402]
C20  2.2uF  C-USC0603K  [C0603K]
C21  0.1uF  C-USC0402  [C0402]
C40  0.1uF  C-USC0402  [C0402]
C41  0.1uF  C-USC0402  [C0402]
C42  0.1uF  C-USC0402  [C0402]
C43  0.1uF  C-USC0402  [C0402]
C44  12pF  C-USC0402  [C0402]
C45  12pF  C-USC0402  [C0402]
C46  0.1uF  C-USC0402  [C0402]
C47  12pF  C-USC0402  [C0402]
C48  12pF  C-USC0402  [C0402]
D0  LEDCHIPLED_0603  [CHIPLED_0603]
H1  MOUNT-HOLE3.2  [3,2]
H4  MOUNT-HOLE3.2  [3,2]
H6  MOUNT-HOLE3.2  [3,2]
J1  JUMPER  [JUMP]
J2  JUMPER  [JUMP]
J3  JUMPER  [JUMP]
JP1  PINHD-2X3  [2X03]
JP2  PINHD-1X2  [1X02]
JP3  PINHD-1X2  [1X02]
R9  330  R-US_R0402  [R0402]
R17  100k  R-US_R0402  [R0402]
R25  4.87k 1%  R-US_R0402  [R0402]
R26  100k  R-US_R0402  [R0402]
R35  10k  R-US_R0402  [R0402]
R36  100k  R-US_R0402  [R0402]
R38  51  R-US_R0402  [R0402]
R39  0  R-US_R0402  [R0402]
R41  0  R-US_R0402  [R0402]
R42  1M  R-US_R0402  [R0402]
R44  10k  R-US_R0402  [R0402]
R48  R-US_R0402  [R0402]
R49  2k  R-US_R0402  [R0402]
R51  100  R-US_R0402  [R0402]
RESET  SWITCH_TACTILE  [SWITCH_6MM_6MM_TE_CON_SMD]
TP3  TPPAD1-13  [P1-13]
TP8  TPPAD1-13  [P1-13]
TP9  TPPAD1-13  [P1-13]
TP10  TPPAD1-13  [P1-13]
TP11  TPPAD1-13  [P1-13]
TP12  TPPAD1-13  [P1-13]
TP13  TPPAD1-13  [P1-13]
U4  TPS2052B_DRB_8  [DRB8_2P4X1P65]
U5  TPS73733_DRV_6  [DRV6_1P6X1]
WAKE  SWITCH_TACTILE  [SWITCH_6MM_6MM_TE_CON_SMD]
Y1  25Mhz  NX3225GA  [NDK3.2X2.5]
Y3  CRYATL_32K_SMD  [CRYSTAL_32K_SMD]

### Nets
!HIB: TP9.TP U1.P$65(!HIB)
!TARGET_RESET: R51.1 RESET.P$3 RESET.P$4 ; also sheet 2,3,6
!TARGET_RESET_FILTERED: C46.1 R44.2 R51.2 U1.P$70(!RESET)
!WAKE: R42.2 TP10.TP U1.P$64(!WAKE) WAKE.P$1 WAKE.P$2 ; also sheet 3
+3V3: D0.A JP2.1 JP3.1 ; also sheet 2,3,6
+5V: C21.1 R17.1 U4.7(OUT1) U5.6(IN) ; also sheet 2,3
DEBUG_VBUS: JP1.5 ; also sheet 6
EN0RXI_N [Ethernet]: U1.P$53(EN0RXIN) ; also sheet 4
EN0RXI_P [Ethernet]: U1.P$54(EN0RXIP) ; also sheet 4
EN0TXO_N [Ethernet]: U1.P$56(EN0TXON) ; also sheet 4
EN0TXO_P [Ethernet]: U1.P$57(EN0TXOP) ; also sheet 4
GND: C3.2 C4.2 C14.2 C15.2 C19.2 C20.2 C21.2 C40.2 C41.2 C42.2 C43.2 C44.2 C45.2 C46.2 C47.2 C48.2 R9.1 R25.2 R26.2 RESET.P$1 RESET.P$2 U1.P$10(GNDA) U1.P$17(GND) U1.P$48(GND) U1.P$55(GND) U1.P$58(GND) U1.P$80(GND) U1.P$114(GND) U4.1(GND) U4.9(EPAD) U4.V(VIA) U4.V_2(VIA) U4.V_3(VIA) U4.V_4(VIA) U4.V_5(VIA) U4.V_6(VIA) U5.3(GND) U5.7(EPAD) U5.V(VIA) U5.V_2(VIA) WAKE.P$3 WAKE.P$4 ; also sheet 1,2,3,4,6
MCU_3V3: C40.1 C41.1 C42.1 C43.1 JP2.2 R39.2 R41.2 R44.1 U1.P$7(VDD) U1.P$8(VDDA) U1.P$16(VDD) U1.P$26(VDD) U1.P$28(VDD) U1.P$39(VDD) U1.P$47(VDD) U1.P$51(VDD) U1.P$52(VDD) U1.P$69(VDD) U1.P$79(VDD) U1.P$90(VDD) U1.P$101(VDD) U1.P$113(VDD) U1.P$122(VDD) ; also sheet 4,6
N$3: D0.C R9.2
N$7: R26.1 R35.2 U4.3(*EN1)
N$9: C19.1 R48.1 U5.2(NR/FB)
N$10: R36.1 TP8.TP U4.8(*OC1)
N$11: C3.1 R38.2 U1.P$68(VBAT)
N$13: C20.1 JP3.2 R48.2 U5.1(OUT)
N$16: R49.2 U1.P$89(OSC1)
N$29: C45.1 R49.1 Y1.P$1(OSC0)
N$30: C47.1 U1.P$67(XOSC1) Y3.P$2
N$31: C44.1 U1.P$88(OSC0) Y1.P$3(OSC1)
N$33: C48.1 U1.P$66(XOSC0) Y3.P$1
PD6: U4.4(*EN2) ; also sheet 1,3
PQ4: U4.5(*OC2) ; also sheet 1,3
RBIAS: R25.1 U1.P$59(RBIAS)
TARGET_VBUS: JP1.3 U4.6(OUT2) ; also sheet 1,3
TARGET_VDDC: C4.1 C14.1 C15.1 TP12.TP U1.P$87(VDDC) U1.P$115(VDDC)
VBAT: R38.1 R39.1 R42.1 TP11.TP
VBUS: JP1.2 JP1.4 JP1.6 R35.1 R36.2 U4.2(IN)
VREF+: R41.1 TP13.TP U1.P$9(VREFA+) ; also sheet 3
VREG_EN: R17.2 TP3.TP U5.4(EN)
Unconnected: JP1.1 U5.5(NC) Y1.P$2(NC2) Y1.P$4(NC4)

### Notes on the sheet
- JP2 can be used to measure MCU current 
  consumption with a multi-meter.
- R38 and C3 Used to meet 
  VBAT rise time requirements
- Power Control Jumper:
  
  1) To power from Debug install jumper on pins 5 - 6
  
  2) To power from Target USB install jumper on pins 3 - 4
  
  3) To power from BoosterPack 5V install jumper on pins 1 - 2
      This is also the off position if BoosterPack does not 
      supply power
  
      When powered from BoosterPack TPS2052B does not 
      provide current limit protection.
     
      When powered by BoosterPack, USB host mode does not 
      supply power to connected devices
- R41 may be removed and precision
  reference applied to TP13
- Primary 3.3V regulator
  Disconnect JP3 to power device from 3V3 BoosterPack
- TPS2052B provides current limit for main 5V power.
  
  Also provides power switching for USB host/OTG modes
  
  For Host/OTG: 
  PD6 configured as USB0EPEN peripheral function.
  
  PQ4 configure as individual pin interrupt. Indicates 
  power fault on the USB bus. USB0PFLT peipheral pin 
  not available due to pin mux and use on BoosterPacks.
  
  USB Host mode does not supply power to devices
  when powered from a BoosterPack
  
  For Applications that do not use USB:
  Configure PD6 as input with internal pull-down 
  enabled.  Turns off power to TARGET_VBUS

## Sheet 6 of 6: In Circuit Debug
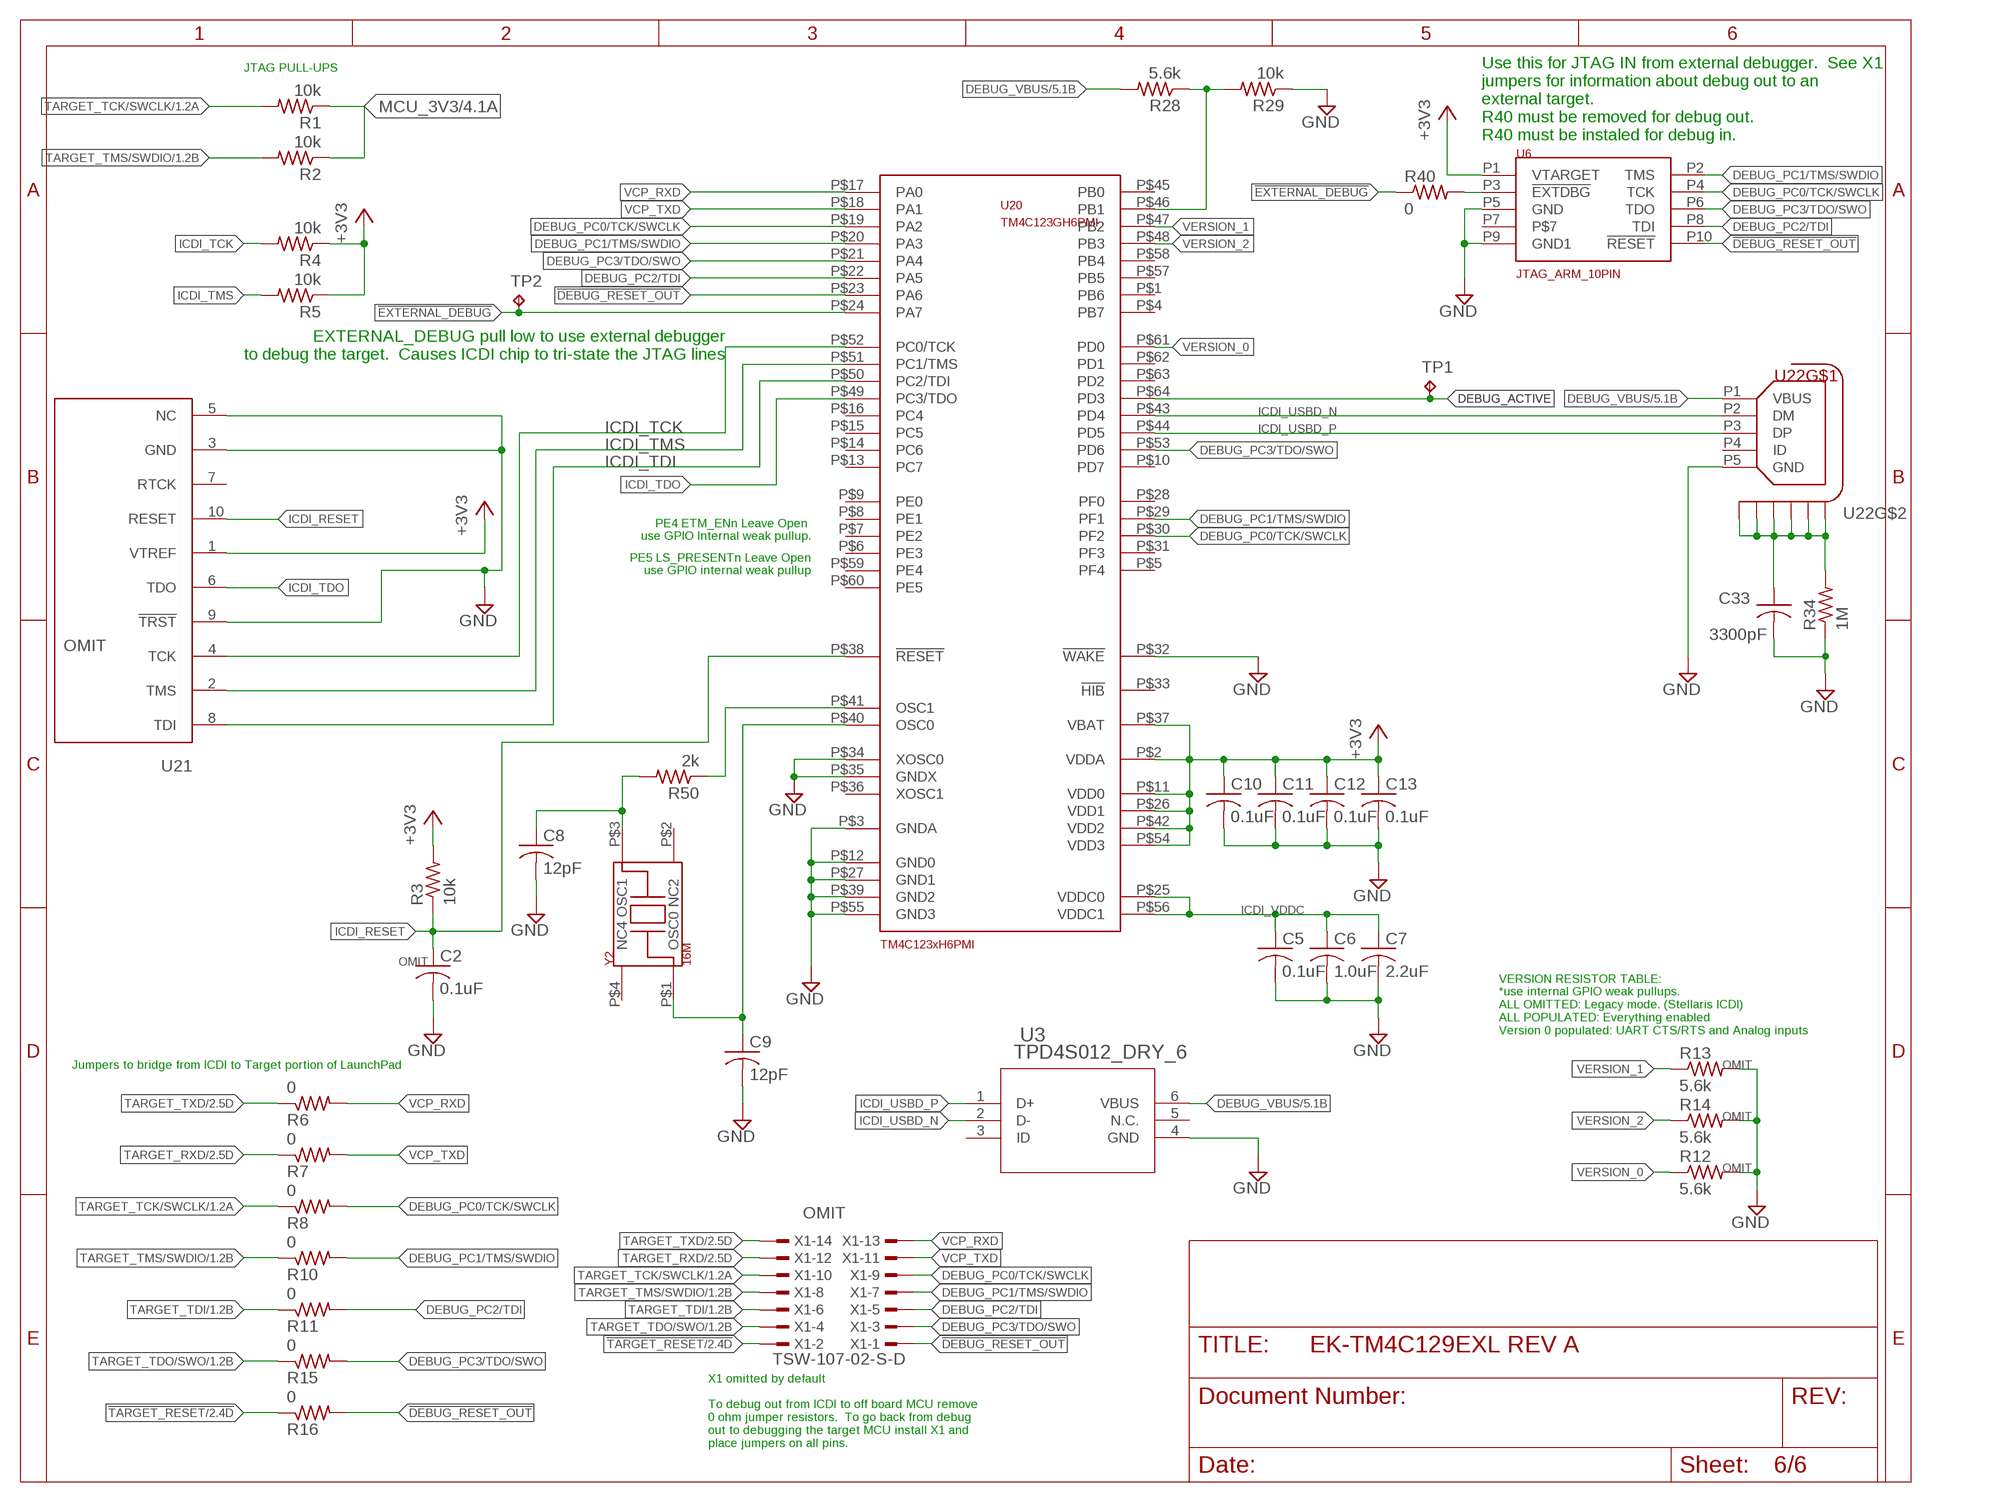
[diagram p5: schematic, sheet 6]

### Parts
C2  0.1uF  C-USC0402  [C0402]
C5  0.1uF  C-USC0402  [C0402]
C6  1.0uF  C-USC0402  [C0402]
C7  2.2uF  C-USC0603  [C0603]
C8  12pF  C-USC0402  [C0402]
C9  12pF  C-USC0402  [C0402]
C10  0.1uF  C-USC0402  [C0402]
C11  0.1uF  C-USC0402  [C0402]
C12  0.1uF  C-USC0402  [C0402]
C13  0.1uF  C-USC0402  [C0402]
C33  3300pF  C-USC0603  [C0603]
R1  10k  R-US_R0402  [R0402]
R2  10k  R-US_R0402  [R0402]
R3  10k  R-US_R0402  [R0402]
R4  10k  R-US_R0402  [R0402]
R5  10k  R-US_R0402  [R0402]
R6  0  R-US_R0402  [R0402]
R7  0  R-US_R0402  [R0402]
R8  0  R-US_R0402  [R0402]
R10  0  R-US_R0402  [R0402]
R11  0  R-US_R0402  [R0402]
R12  5.6k  R-US_R0402  [R0402]
R13  5.6k  R-US_R0402  [R0402]
R14  5.6k  R-US_R0402  [R0402]
R15  0  R-US_R0402  [R0402]
R16  0  R-US_R0402  [R0402]
R28  5.6k  R-US_R0402  [R0402]
R29  10k  R-US_R0402  [R0402]
R34  1M  R-US_R0603  [R0603]
R40  0  R-US_R0402  [R0402]
R50  2k  R-US_R0402  [R0402]
TP1  TPPAD1-13  [P1-13]
TP2  TPPAD1-13  [P1-13]
U3  TPD4S012_DRY_6  [DRY6]
U6  JTAG_ARM_10PIN  [CON_2X5_50MIL]
U20  TM4C123GH6PMI  [LQFP-64-PM]
U21  TC2050-NL-MCP-NL  [TC2030-MCP-NL]
U22  CON_USB_FCI_MICRO_B_10118194  [CON_USB_MICRO_B_FCI_10118194]
X1  TSW-107-02-S-D  [TSW-107-02-S-D]
Y2  16M  NX3225GA  [NDK3.2X2.5]

### Nets
!DEBUG_RESET_OUT: R16.2 U6.P10(!RESET) U20.P$23(PA6) X1.1
!EXTERNAL_DEBUG: R40.1 TP2.TP U20.P$24(PA7)
!TARGET_RESET: R16.1 X1.2 ; also sheet 2,3,5
+3V3: C10.1 C11.1 C12.1 C13.1 R3.2 R4.1 R5.1 U6.P1(VTARGET) U20.P$2(VDDA) U20.P$11(VDD0) U20.P$26(VDD1) U20.P$37(VBAT) U20.P$42(VDD2) U20.P$54(VDD3) U21.1(VTREF) ; also sheet 2,3,5
DEBUG_ACTIVE: TP1.TP U20.P$64(PD3)
DEBUG_PC0/TCK/SWCLK: R8.2 U6.P4(TCK) U20.P$19(PA2) U20.P$30(PF2) X1.9
DEBUG_PC1/TMS/SWDIO: R10.2 U6.P2(TMS) U20.P$20(PA3) U20.P$29(PF1) X1.7
DEBUG_PC2/TDI: R11.2 U6.P8(TDI) U20.P$22(PA5) X1.5
DEBUG_PC3/TDO/SWO: R15.2 U6.P6(TDO) U20.P$21(PA4) U20.P$53(PD6) X1.3
DEBUG_VBUS: R28.2 U3.6(VBUS) U22.P1(VBUS) ; also sheet 5
GND: C2.2 C5.2 C6.2 C7.2 C8.2 C9.2 C10.2 C11.2 C12.2 C13.2 C33.2 R12.2 R13.2 R14.2 R29.1 R34.1 U3.4(GND) U6.P5(GND) U6.P9(GND1) U20.P$3(GNDA) U20.P$12(GND0) U20.P$27(GND1) U20.P$32(!WAKE) U20.P$34(XOSC0) U20.P$35(GNDX) U20.P$39(GND2) U20.P$55(GND3) U21.3(GND) U21.5(NC) U21.9(!TRST) U22.P5(GND) ; also sheet 1,2,3,4,5
ICDI_RESET: C2.1 R3.1 U20.P$38(!RESET) U21.10(RESET)
ICDI_TCK: R4.2 U20.P$52(PC0/TCK) U21.4(TCK)
ICDI_TDI: U20.P$50(PC2/TDI) U21.8(TDI)
ICDI_TDO: U20.P$49(PC3/TDO) U21.6(TDO)
ICDI_TMS: R5.2 U20.P$51(PC1/TMS) U21.2(TMS)
ICDI_USBD_N [USB]: U3.2(D-) U20.P$43(PD4) U22.P2(DM)
ICDI_USBD_P [USB]: U3.1(D+) U20.P$44(PD5) U22.P3(DP)
ICDI_VDDC: C5.1 C6.1 C7.1 U20.P$25(VDDC0) U20.P$56(VDDC1)
MCU_3V3: R1.1 R2.1 ; also sheet 4,5
N$1: C9.1 U20.P$40(OSC0) Y2.P$1(OSC0)
N$2: C8.1 R50.2 Y2.P$3(OSC1)
N$12: R40.2 U6.P3(!EXTDBG)
N$15: R28.1 R29.2 U20.P$46(PB1)
N$17: R50.1 U20.P$41(OSC1)
N$20: C33.1 R34.2 U22.P6(S1) U22.P7(S2) U22.P8(S3) U22.P9(S4) U22.P10(S5) U22.P11(S6)
TARGET_RXD: R7.1 X1.12 ; also sheet 2
TARGET_TCK/SWCLK: R1.2 R8.1 X1.10 ; also sheet 1
TARGET_TDI: R11.1 X1.6 ; also sheet 1
TARGET_TDO/SWO: R15.1 X1.4 ; also sheet 1
TARGET_TMS/SWDIO: R2.2 R10.1 X1.8 ; also sheet 1
TARGET_TXD: R6.1 X1.14 ; also sheet 2
VCP_RXD: R6.2 U20.P$17(PA0) X1.13
VCP_TXD: R7.2 U20.P$18(PA1) X1.11
VERSION_0: R12.1 U20.P$61(PD0)
VERSION_1: R13.1 U20.P$47(PB2)
VERSION_2: R14.1 U20.P$48(PB3)
Unconnected: U3.3(ID) U3.5(N.C.) U6.P7 U20.P$1(PB6) U20.P$4(PB7) U20.P$5(PF4) U20.P$6(PE3) U20.P$7(PE2) U20.P$8(PE1) U20.P$9(PE0) U20.P$10(PD7) U20.P$13(PC7) U20.P$14(PC6) U20.P$15(PC5) U20.P$16(PC4) U20.P$28(PF0) U20.P$31(PF3) U20.P$33(!HIB) U20.P$36(XOSC1) U20.P$45(PB0) U20.P$57(PB5) U20.P$58(PB4) U20.P$59(PE4) U20.P$60(PE5) U20.P$62(PD1) U20.P$63(PD2) U21.7(RTCK) U22.P4(ID) Y2.P$2(NC2) Y2.P$4(NC4)

### Notes on the sheet
- JTAG PULL-UPS
- Use this for JTAG IN from external debugger.  See X1 
  jumpers for information about debug out to an 
  external target. 
  R40 must be removed for debug out.
  R40 must be instaled for debug in.
- EXTERNAL_DEBUG pull low to use external debugger
  to debug the target.  Causes ICDI chip to tri-state the JTAG lines
- PE4 ETM_ENn Leave Open 
  use GPIO Internal weak pullup.
- PE5 LS_PRESENTn Leave Open
  use GPIO internal weak pullup
- VERSION RESISTOR TABLE:
  *use internal GPIO weak pullups.
  ALL OMITTED: Legacy mode. (Stellaris ICDI)
  ALL POPULATED: Everything enabled
  Version 0 populated: UART CTS/RTS and Analog inputs
- Jumpers to bridge from ICDI to Target portion of LaunchPad
- X1 omitted by default
  
  To debug out from ICDI to off board MCU remove 
  0 ohm jumper resistors.  To go back from debug 
  out to debugging the target MCU install X1 and 
  place jumpers on all pins.

## Library data of the parts
C1 = EK-TM4C129EXL REV A:C-US: CAPACITOR, American symbol; GNUM: G10-C1210-C102-ZCA
C2 = ek-tm4c129exl:C-US: CAPACITOR, American symbol; GNUM: G10-C0402-C104-HBA; POPOP: OMIT
C3-C5 C10-C13 C16-C19 C21-C30 C40-C43 C46 = ek-tm4c129exl:C-US: CAPACITOR, American symbol; GNUM: G10-C0402-C104-HBA
C6 C14 = ek-tm4c129exl:C-US: CAPACITOR, American symbol; GNUM: G10-C0402-C105-GBB
C7 = ek-tm4c129exl:C-US: CAPACITOR, American symbol; GNUM: G10-C0603-C225-HBB
C8 C9 C44 C45 C47 C48 = ek-tm4c129exl:C-US: CAPACITOR, American symbol; GNUM: G10-C0402-C120-AAC
C15 C20 = ek-tm4c129exl:C-US: CAPACITOR, American symbol; DIGIKEY_PARTNUM: 311-1451-2-ND; GNUM: G10-C0603-C225-HBB
C31 = ek-tm4c129exl:C-US: CAPACITOR, American symbol; GNUM: G10-C1812-C472-ZBA
C32 C33 = EK-TM4C129EXL REV A:C-US: CAPACITOR, American symbol; GNUM: G10-C0603-C332-ABA
D0 D1-D4 = ek-tm4c129exl:LED: LED OSRAM: - CHIPLED LG R971, LG N971, LY N971, LG Q971, LY Q971, LO R971, LY R971 LH N974, LH R974 LS Q976, LO Q976, LY Q976 LO Q996 - Hyper CHIPLED LW Q18S LB Q993, LB Q99A, LB R99A - SideLED LS A670, LO A670, LY A670, LG A670, LP A670 LB A673, LV A673, LT A673, LW A673 LH A674 LY A675 LS A676, LA A676, LO A676, LY A676, LW A676 LS A679, LY A679, LG A679 - Hyper Micro SIDELED® LS Y876, LA Y876, LO Y876, LY Y876 LT Y87S - SmartLED LW L88C, LW L88S LB L89C, LB L89S, LG L890 LS L89K, LO L89K, LY L89K LS L896, LA L896, LO L896, LY L896 - TOPLED LS T670, LO T670, LY T670, LG T670, LP T670 LSG T670, LSP T670, LSY T670, LOP T670, LYG T670 LG T671, LOG T671, LSG T671 LB T673, LV T673, LT T673, LW T673 LH T674 LS T676, LA T676, LO T676, LY T676, LB T676, LH T676, LSB T676, LW T676 LB T67C, LV T67C, LT T67C, LS T67K, LO T67K, LY T67K, LW E67C LS E67B, LA E67B, LO E67B, LY E67B, LB E67C, LV E67C, LT E67C LW T67C LS T679, LY T679, LG T679 LS T770, LO T770, LY T770, LG T770, LP T770 LB T773, LV T773, LT T773, LW T773 LH T774 LS E675, LA E675, LY E675, LS T675 LS T776, LA T776, LO T776, LY T776, LB T776 LHGB T686 LT T68C, LB T68C - Hyper Mini TOPLED® LB M676 - Mini TOPLED Santana® LG M470 LS M47K, LO M47K, LY M47K Source: http://www.osram.convergy.de LUXEON: - LUMILED® LXK2-PW12-R00, LXK2-PW12-S00, LXK2-PW14-U00, LXK2-PW14-V00 LXK2-PM12-R00, LXK2-PM12-S00, LXK2-PM14-U00 LXK2-PE12-Q00, LXK2-PE12-R00, LXK2-PE12-S00, LXK2-PE14-T00, LXK2-PE14-U00 LXK2-PB12-K00, LXK2-PB12-L00, LXK2-PB12-M00, LXK2-PB14-N00, LXK2-PB14-P00, LXK2-PB14-Q00 LXK2-PR12-L00, LXK2-PR12-M00, LXK2-PR14-Q00, LXK2-PR14-R00 LXK2-PD12-Q00, LXK2-PD12-R00, LXK2-PD12-S00 LXK2-PH12-R00, LXK2-PH12-S00 LXK2-PL12-P00, LXK2-PL12-Q00, LXK2-PL12-R00 Source: www.luxeon.com KINGBRIGHT: KA-3528ASYC Source: www.kingbright.com; GNUM: G14-D0603-GR00-AAA
H1 H4 H6 = holes:MOUNT-HOLE: MOUNTING HOLE with drill center marker; GNUM: G30-62S04-A112-AAA; POPOP: OMIT
J1-J7 = jumper:JUMPER: JUMPER header; GNUM: G72-100MI-JMPA-AAA
JP1 = pinhead:PINHD-2X3: PIN HEADER; GNUM: G22-THVEU-2X3P-BAB
JP2 JP3 = pinhead:PINHD-1X2: PIN HEADER; GNUM: G22-THVEU-002P-AAA
JP4 JP5 = pinhead:PINHD-2X2: PIN HEADER; GNUM: G22-THVEU-002P-BAB
R1-R5 R29 R35 R44 = ek-tm4c129exl:R-US_: RESISTOR, American symbol; GNUM: G11-R0402-1002-AAA
R6-R8 R10 R11 R15 R16 R19 R20 R39-R41 = ek-tm4c129exl:R-US_: RESISTOR, American symbol; GNUM: G11-R0402-0000-AAA
R9 R27 R30 R31 R33 = ek-tm4c129exl:R-US_: RESISTOR, American symbol; GNUM: G11-R0402-3300-AAA
R12-R14 = ek-tm4c129exl:R-US_: RESISTOR, American symbol; GNUM: G11-R0402-5601-AAA; POPOP: OMIT
R17 R26 R36 = ek-tm4c129exl:R-US_: RESISTOR, American symbol; GNUM: G11-R0402-1003-AAA
R18 R51 = ek-tm4c129exl:R-US_: RESISTOR, American symbol; GNUM: G11-R0402-1000-AAA
R21-R24 = ek-tm4c129exl:R-US_: RESISTOR, American symbol; GNUM: G11-R0402-49R9-ABA
R25 = ek-tm4c129exl:R-US_: RESISTOR, American symbol; GNUM: G11-R0402-4871-ABA
R28 = ek-tm4c129exl:R-US_: RESISTOR, American symbol; GNUM: G11-R0402-5601-AAA
R32 R43 R45 R46 = ek-tm4c129exl:R-US_: RESISTOR, American symbol; GNUM: G11-R0402-75R0-AAA
R34 R52 = EK-TM4C129EXL REV A:R-US_: RESISTOR, American symbol; GNUM: G11-R0603-R105-AAA
R38 = ek-tm4c129exl:R-US_: RESISTOR, American symbol; GNUM: G11-R0402-51R0-AAA
R42 = ek-tm4c129exl:R-US_: RESISTOR, American symbol; GNUM: G11-R0402-1004-AAA
R47 = EK-TM4C129EXL REV A:R-US_: RESISTOR, American symbol; GNUM: G11-R1206-R105-CAA
R48 = ek-tm4c129exl:R-US_: RESISTOR, American symbol; GNUM: G11-R0402-5232-ABA; POPOP: OMIT
R49 R50 = ek-tm4c129exl:R-US_: RESISTOR, American symbol; GNUM: G11-R0402-R202-AAA
RESET USR_SW1 USR_SW2 WAKE = ek-tm4c129exl:SWITCH_TACTILE; GNUM: G21-4P6MM-B3S1-AAA
TP1-TP17 = ek-tm4c129exl:TP: Test pad; GNUM: G20-K5000-TP00-AAA; POPOP: OMIT
U1 = EK-TM4C129EXL REV A:TM4C129ENCPDT; GNUM: G50-QF128-C1294-ALH
U2 U3 = ek-tm4c129exl:TPD4S012_DRY_6; DATASHEETURL: http://www.ti.com/lit/gpn/TPD4S012; DESCRIPTION: 4-Channel USB ESD Solution with Power Clamp; FAMILY_NAME: ESD Solution; GENERIC_PART_NUMBER: TPD4S012; GNUM: G57-SMDRY-S012-AAA; INDUSTRY_STD_PKG_TYPE: SON; MANUFACTURER: Texas Instruments; MANUFACTURER_PART_NUMBER: tpd4s012_dry_6; PACKAGE_DESIGNATOR: DRY; PIN_COUNT: 6; VENDOR: Texas Instruments
U4 = ek-tm4c129exl:TPS2052B_DRB_8; DATASHEETURL: http://www.ti.com/lit/gpn/TPS2052B; DESCRIPTION: Current-Limited, Power-Distribution Switches; FAMILY_NAME: USB POWER SWITCH; GENERIC_PART_NUMBER: TPS2052B; GNUM: G57-08SON-2052-AAA; INDUSTRY_STD_PKG_TYPE: SON; MANUFACTURER: Texas Instruments; MANUFACTURER_PART_NUMBER: tps2052b_drb_8; PACKAGE_DESIGNATOR: DRB; PIN_COUNT: 8; VENDOR: Texas Instruments
U5 = ek-tm4c129exl:TPS73733_DRV_6; GNUM: G51-DRV06-T733-AAA
U6 = ek-tm4c129exl:JTAG_ARM_10PIN; GNUM: G22-SMVES-2X5A-BBC
U7 = ek-tm4c129exl:CON_USB_HIROSE_MICRO_AB_ZX62D_AB_5P8; GNUM: G20-USBU-THAB-CEB
U10 = ek-tm4c129exl:MAG_PULSE_HX1188FNL; GNUM: G12-SOI16-1TO1-ZZQ
U13 = ek-tm4c129exl:SLVU2.8-4; GNUM: G14-SOIC8-SLVU-DAA
U14 = ek-tm4c129exl:JACK_RJ45_NOMAG_NOLED_TECON; GNUM: G20-8RJ45-ENET-AAA
U20 = ek-tm4c129exl:TM4C123GH6PMI; GNUM: G50-QFP64-F120-EGC
U21 = ek-tm4c129exl:TC2050-NL: TAG-CONNECT ISP Connector Manufacturer: Tag-Connect <www.tag-connect.com> Cable for easy In-Circuit PCB Programming. Designed for JTAG 10 pin, suitable for many others. Pin Connection for TC2050 NL. PAD Description 1 VTREF 2 TMS 3 GND 4 TCK 5 NC 6 TDO 7 RTCK 8 TDI 9 !TRST 10 RESET ©2009 ROFA.cz Modified 7/2011 by Tim McCarthy-Smith VIDA Products INC; POPOP: OMIT
U22 = ek-tm4c129exl:CON_USB_FCI_MICRO_B_10118194; GNUM: G20-USBU-THB-CEB
X1 = ek-tm4c129exl:TSW-107-02-S-D: THROUGH-HOLE .025" SQ POST HEADER Source: Samtec TSW.pdf; GNUM: G22-THVEU-2X7P-BAB; OC_FARNELL: unknown; OC_NEWARK: unknown; POPOP: OMIT
X6-X9 = ek-tm4c129exl:TSW-110-02-S-D: THROUGH-HOLE .025" SQ POST HEADER Source: Samtec TSW.pdf; GNUM: G22-THSTK-2X10-BAC; OC_FARNELL: unknown; OC_NEWARK: unknown
X11 = con-samtec:TSW-149-02-S-D: THROUGH-HOLE .025" SQ POST HEADER Source: Samtec TSW.pdf; GNUM1: G22-THRE-1x49-AAC; GNUM2: G22-THRA-1X49-AAC; OC_FARNELL: unknown; OC_NEWARK: unknown; POPOP: OMIT
Y1 = ek-tm4c129exl:NX3225GA; GNUM: G15-32X25-2506-AAA
Y2 = ek-tm4c129exl:NX3225GA; GNUM: G15-32X25-1606-AAA
Y3 = EK-TM4C129EXL REV A:CRYATL_32K_SMD; GNUM: G15-CMR2T-3272-AAA

## Net classes
1 USB: width 0.275 mm, clearance 0.152 mm
2 Ethernet: width 0.22 mm, clearance 0.152 mm